# EAGLE design Servo2015_Logic_V1.2 (EAGLE 6.3)

## Sheet 1 of 4: Spannungsversorg
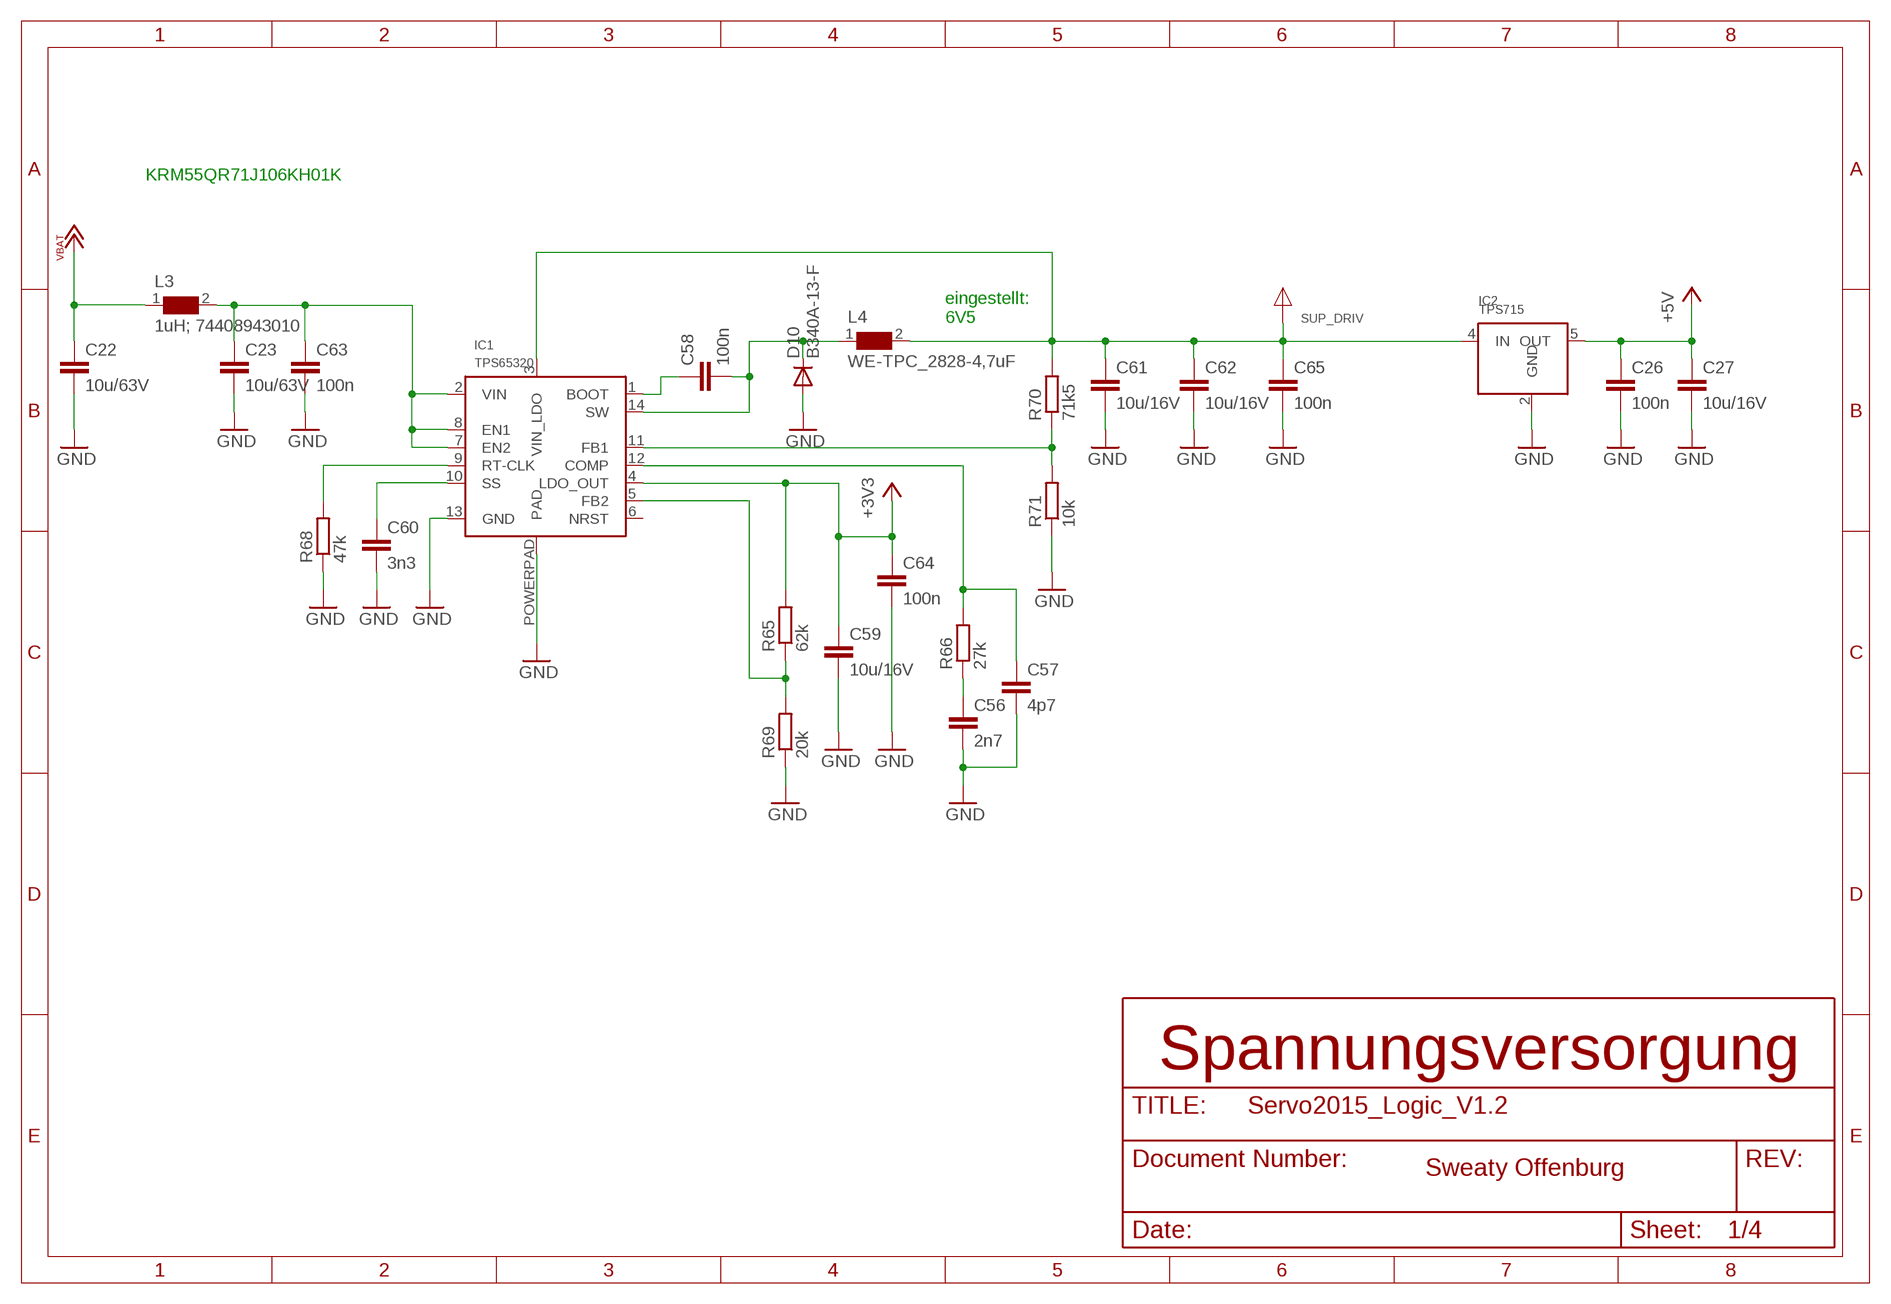
[diagram p0: schematic, sheet 1]

### Parts
C22  10u/63V  C-EUC2220K  [C2220K]
C23  10u/63V  C-EUC2220K  [C2220K]
C26  100n  C-EUC0603  [C0603]
C27  10u/16V  C-EUC0805  [C0805]
C56  2n7  C-EUC0603  [C0603]
C57  4p7  C-EUC0603  [C0603]
C58  100n  C-EUC0603  [C0603]
C59  10u/16V  C-EUC0805  [C0805]
C60  3n3  C-EUC0603  [C0603]
C61  10u/16V  C-EUC0805  [C0805]
C62  10u/16V  C-EUC0805  [C0805]
C63  100n  C-EUC0603  [C0603]
C64  100n  C-EUC0603  [C0603]
C65  100n  C-EUC0603  [C0603]
D10  B340A-13-F  [SMA]
IC1  TPS65320  [R.PDSO.G14_PWP]
IC2  TPS715  [SC-70_DCK_R_PDSO_G5]
L3  1uH; 74408943010  WE-SPC_48XX_4838/4828/4818  [WE-SPC_48XX]
L4  WE-TPC_2828-4,7uF  WE-TPC_2828  [WE-TPC_2828]
R65  62k  R-EU_R0603  [R0603]
R66  27k  R-EU_R0603  [R0603]
R68  47k  R-EU_R0603  [R0603]
R69  20k  R-EU_R0603  [R0603]
R70  71k5  R-EU_R0603  [R0603]
R71  10k  R-EU_R0603  [R0603]

### Nets
+3V3: C59.1 C64.1 IC1.4(LDO_OUT) R65.2 ; also sheet 2,3,4
+5V: C26.1 C27.1 IC2.5(OUT) ; also sheet 2,4
GND: C22.2 C23.2 C26.2 C27.2 C56.2 C57.2 C59.2 C60.2 C61.2 C62.2 C63.2 C64.2 C65.2 D10.A IC1.13(GND) IC1.POWERPAD(PAD) IC2.2(GND) R68.1 R69.1 R71.1 ; also sheet 2,3,4
N$16: C57.1 IC1.12(COMP) R66.2
N$17: C56.1 R66.1
N$18: IC1.5(FB2) R65.1 R69.2
N$23: C58.2 D10.C IC1.14(SW) L4.1
N$25: IC1.11(FB1) R70.1 R71.2
N$26: C60.1 IC1.10(SS)
N$27: IC1.9(RT-CLK) R68.2
N$28: C23.1 C63.1 IC1.2(VIN) IC1.7(EN2) IC1.8(EN1) L3.2
N$30: C58.1 IC1.1(BOOT)
SUP_DRIV: C61.1 C62.1 C65.1 IC1.3(VIN_LDO) IC2.4(IN) L4.2 R70.2 ; also sheet 2
VBAT+: C22.1 L3.1 ; also sheet 2
Unconnected: IC1.6(NRST)

### Notes on the sheet
- KRM55QR71J106KH01K
- eingestellt:
  6V5
- Spannungsversorgung
- Sweaty Offenburg

## Sheet 2 of 4
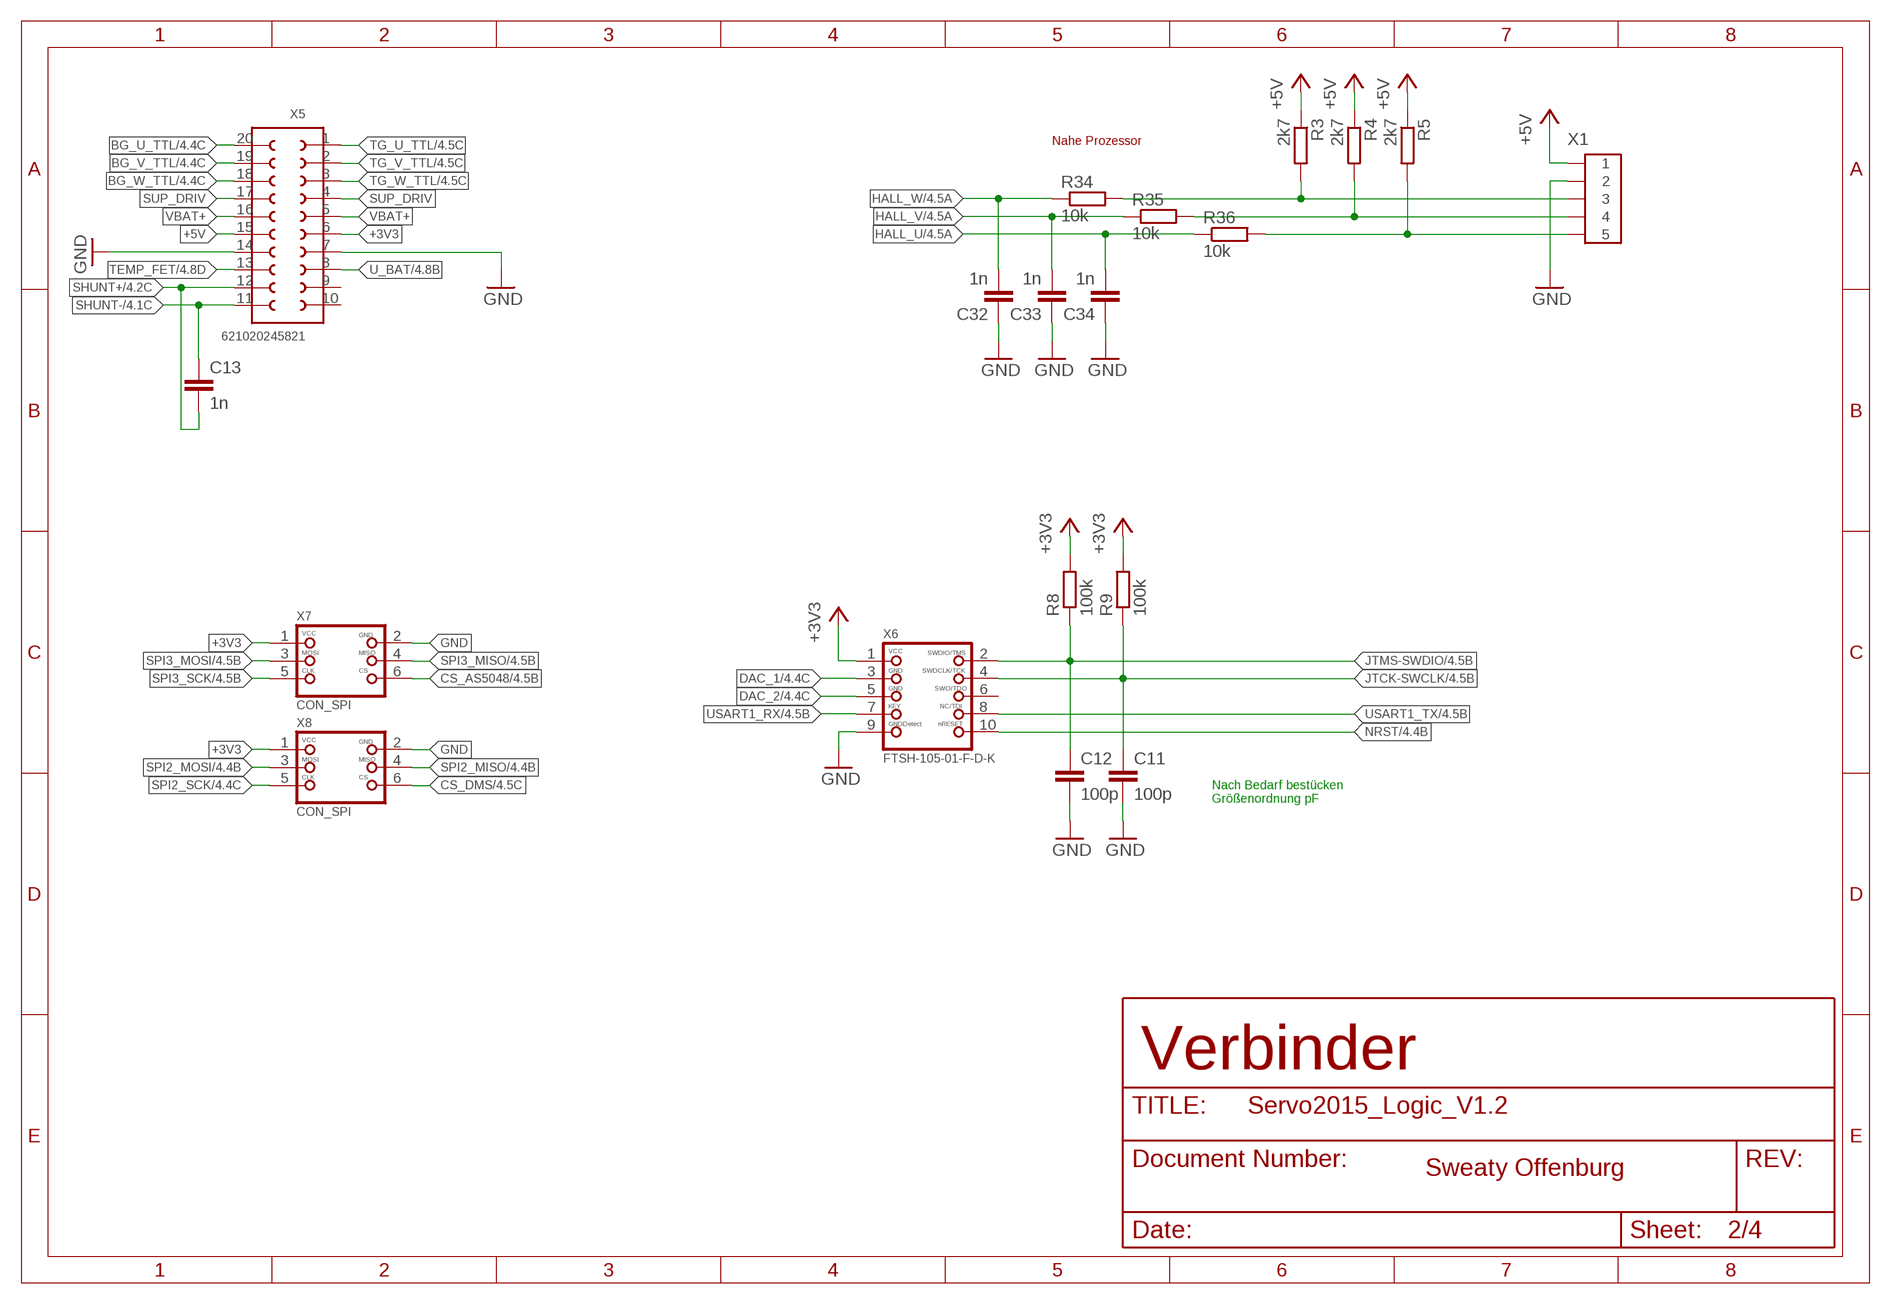
[diagram p1: schematic, sheet 2]

### Parts
C11  100p  C-EUC0603  [C0603]
C12  100p  C-EUC0603  [C0603]
C13  1n  C-EUC0603  [C0603]
C32  1n  C-EUC0603  [C0603]
C33  1n  C-EUC0603  [C0603]
C34  1n  C-EUC0603  [C0603]
R3  2k7  R-EU_R0603  [R0603]
R4  2k7  R-EU_R0603  [R0603]
R5  2k7  R-EU_R0603  [R0603]
R8  100k  R-EU_R0603  [R0603]
R9  100k  R-EU_R0603  [R0603]
R34  10k  R-EU_R0603  [R0603]
R35  10k  R-EU_R0603  [R0603]
R36  10k  R-EU_R0603  [R0603]
X1  HALL-5POL-SERVOBOARD  [MOLEX-SPOX-5POL-VERT]
X5  621020245821  [621020245821]
X6  FTSH-105-01-F-D-K  JTAG-CORTEXM3  [2X05_1.27MM_SMT]
X7  CON_SPI  [2X03_1.27MM_SMT]
X8  CON_SPI  [2X03_1.27MM_SMT]

### Nets
+3V3: R8.2 R9.2 X5.6 X6.1 X7.1 X8.1 ; also sheet 1,3,4
+5V: R3.1 R4.1 R5.1 X1.1 X5.15 ; also sheet 1,4
BG_U_TTL: X5.20 ; also sheet 4
BG_V_TTL: X5.19 ; also sheet 4
BG_W_TTL: X5.18 ; also sheet 4
CS_AS5048: X7.6 ; also sheet 4
CS_DMS: X8.6 ; also sheet 4
DAC_1: X6.3 ; also sheet 4
DAC_2: X6.5 ; also sheet 4
GND: C11.2 C12.2 C32.1 C33.1 C34.1 X1.2 X5.7 X5.14 X6.9 X7.2 X8.2 ; also sheet 1,3,4
HALL_U: C34.2 R36.1 ; also sheet 4
HALL_V: C33.2 R35.1 ; also sheet 4
HALL_W: C32.2 R34.1 ; also sheet 4
JTCK-SWCLK: C11.1 R9.1 X6.4 ; also sheet 4
JTMS-SWDIO: C12.1 R8.1 X6.2 ; also sheet 4
N$4: R3.2 R34.2 X1.3
N$5: R4.2 R35.2 X1.4
N$6: R5.2 R36.2 X1.5
NRST: X6.10 ; also sheet 4
SHUNT+: C13.2 X5.12 ; also sheet 4
SHUNT-: C13.1 X5.11 ; also sheet 4
SPI2_MISO: X8.4 ; also sheet 4
SPI2_MOSI: X8.3 ; also sheet 4
SPI2_SCK: X8.5 ; also sheet 4
SPI3_MISO: X7.4 ; also sheet 4
SPI3_MOSI: X7.3 ; also sheet 4
SPI3_SCK: X7.5 ; also sheet 4
SUP_DRIV: X5.4 X5.17 ; also sheet 1
TEMP_FET: X5.13 ; also sheet 4
TG_U_TTL: X5.1 ; also sheet 4
TG_V_TTL: X5.2 ; also sheet 4
TG_W_TTL: X5.3 ; also sheet 4
U_BAT: X5.8 ; also sheet 4
USART1_RX: X6.7 ; also sheet 4
USART1_TX: X6.8 ; also sheet 4
VBAT+: X5.5 X5.16 ; also sheet 1
Unconnected: X5.9 X5.10 X6.6

### Notes on the sheet
- Nahe Prozessor
- Nach Bedarf bestücken
  Größenordnung pF
- Verbinder
- Sweaty Offenburg

## Sheet 3 of 4: CAN
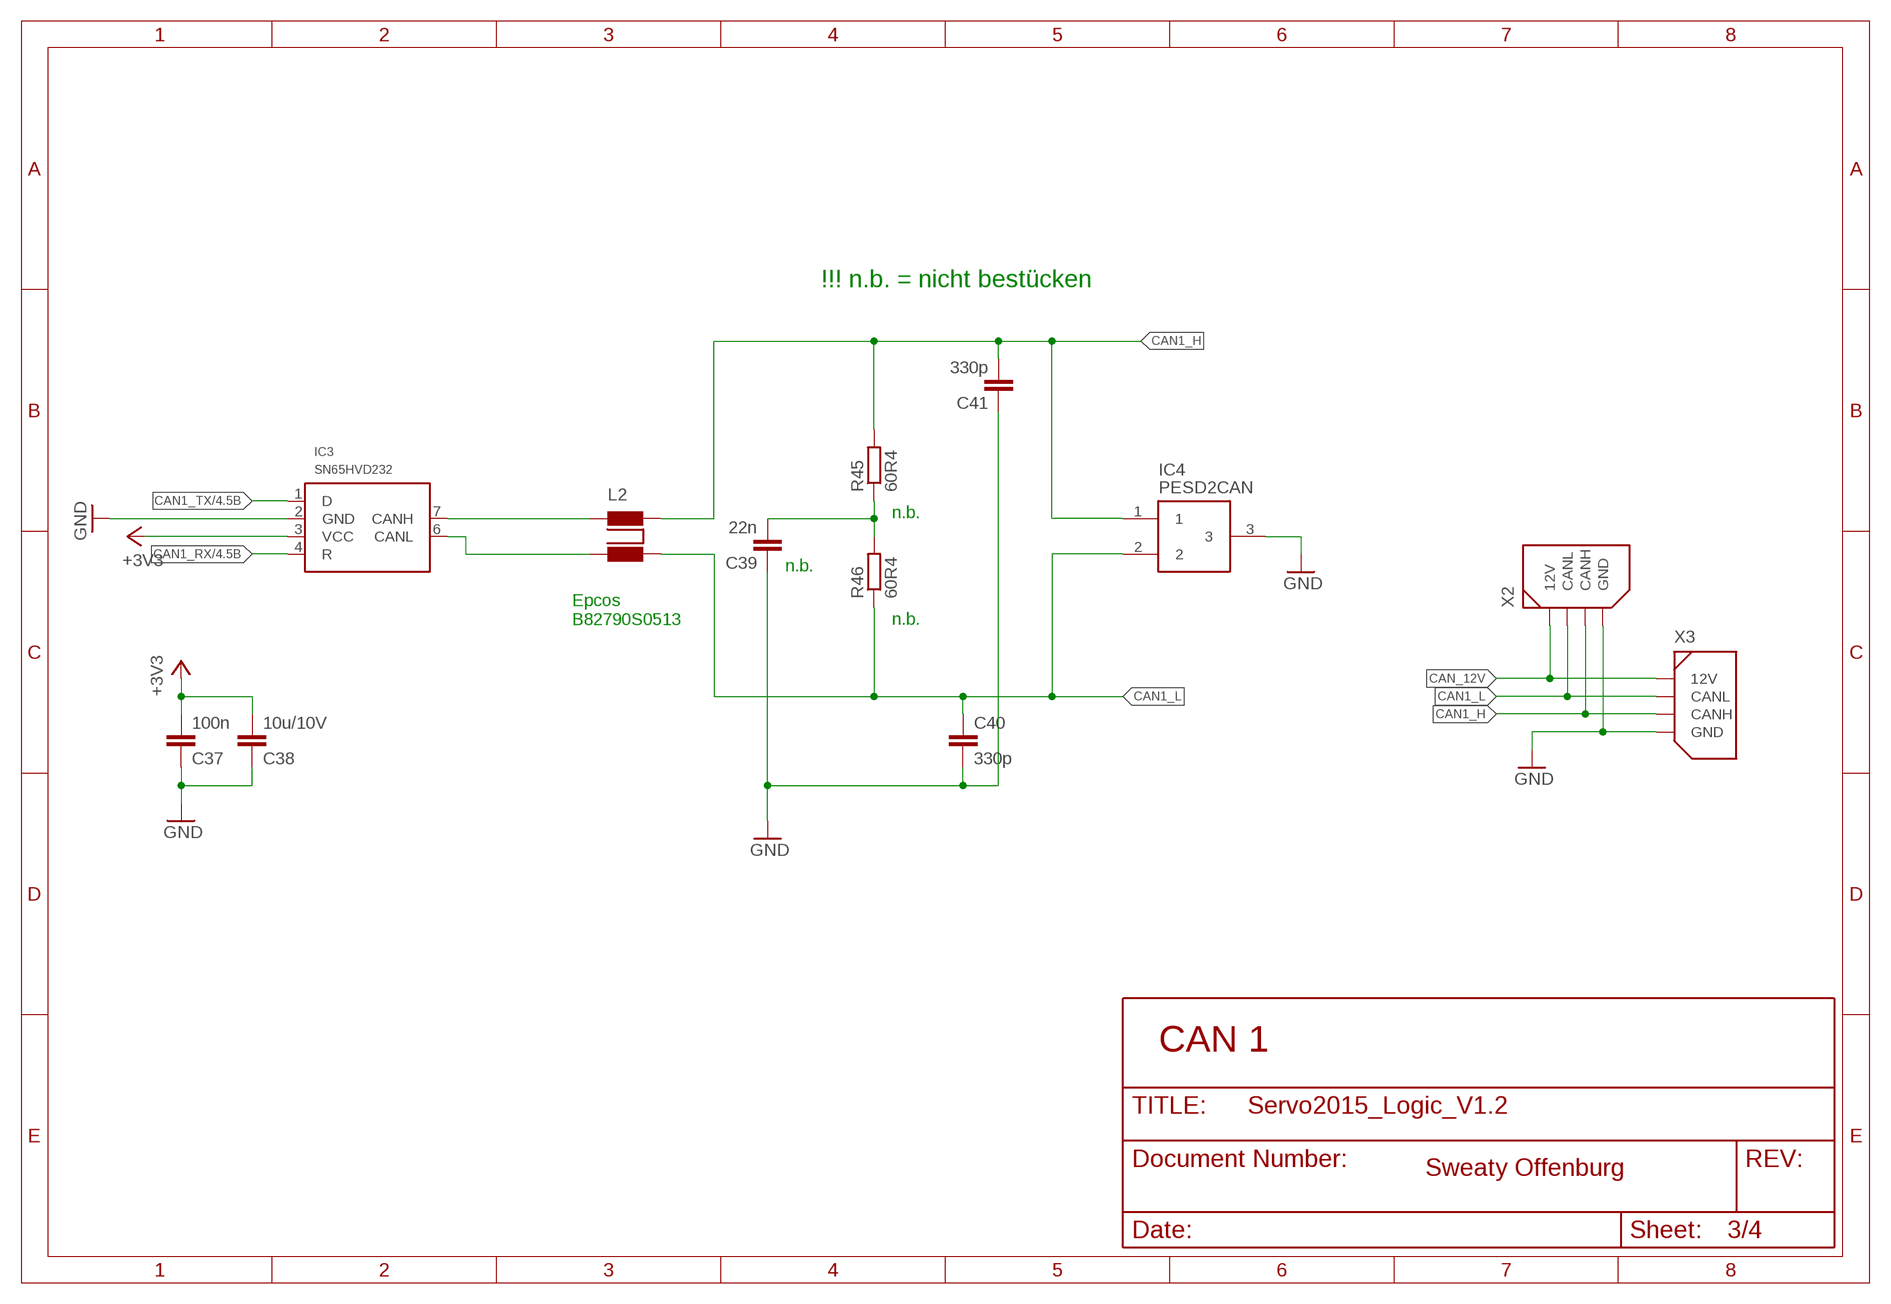
[diagram p2: schematic, sheet 3]

### Parts
C37  100n  C-EUC0603  [C0603]
C38  10u/10V  C-EUC0603  [C0603]
C39  22n  C-EUC0603  [C0603]
C40  330p  C-EUC0603  [C0603]
C41  330p  C-EUC0603  [C0603]
IC3  SN65HVD232  [SO-8]
IC4  PESD2CAN  PESD1CAN  [SOT-23(TO263AB)]
L2  B82790S0513  [B82790C0/S0]
R45  60R4  R-EU_R0805  [R0805]
R46  60R4  R-EU_R0805  [R0805]
X2  CAN-4POL  [MOLEX-SPOX-4PO]
X3  CAN-4POL  [MOLEX-SPOX-4PO]

### Nets
+3V3: C37.2 C38.2 IC3.3(VCC) ; also sheet 1,2,4
CAN1_H: C41.2 IC4.1 L2.2 R45.2 X2.P$3(CANH) X3.P$3(CANH)
CAN1_L: C40.1 IC4.2 L2.3 R46.1 X2.P$2(CANL) X3.P$2(CANL)
CAN1_RX: IC3.4(R) ; also sheet 4
CAN1_TX: IC3.1(D) ; also sheet 4
CAN_12V: X2.P$1(12V) X3.P$1(12V)
GND: C37.1 C38.1 C39.1 C40.2 C41.1 IC3.2(GND) IC4.3 X2.P$4(GND) X3.P$4(GND) ; also sheet 1,2,4
N$38: C39.2 R45.1 R46.2
N$89: IC3.7(CANH) L2.1
N$96: IC3.6(CANL) L2.4

### Notes on the sheet
- !!! n.b. = nicht bestücken
- n.b.
- n.b.
- Epcos 
  B82790S0513
- n.b.
- CAN 1
- Sweaty Offenburg

## Sheet 4 of 4
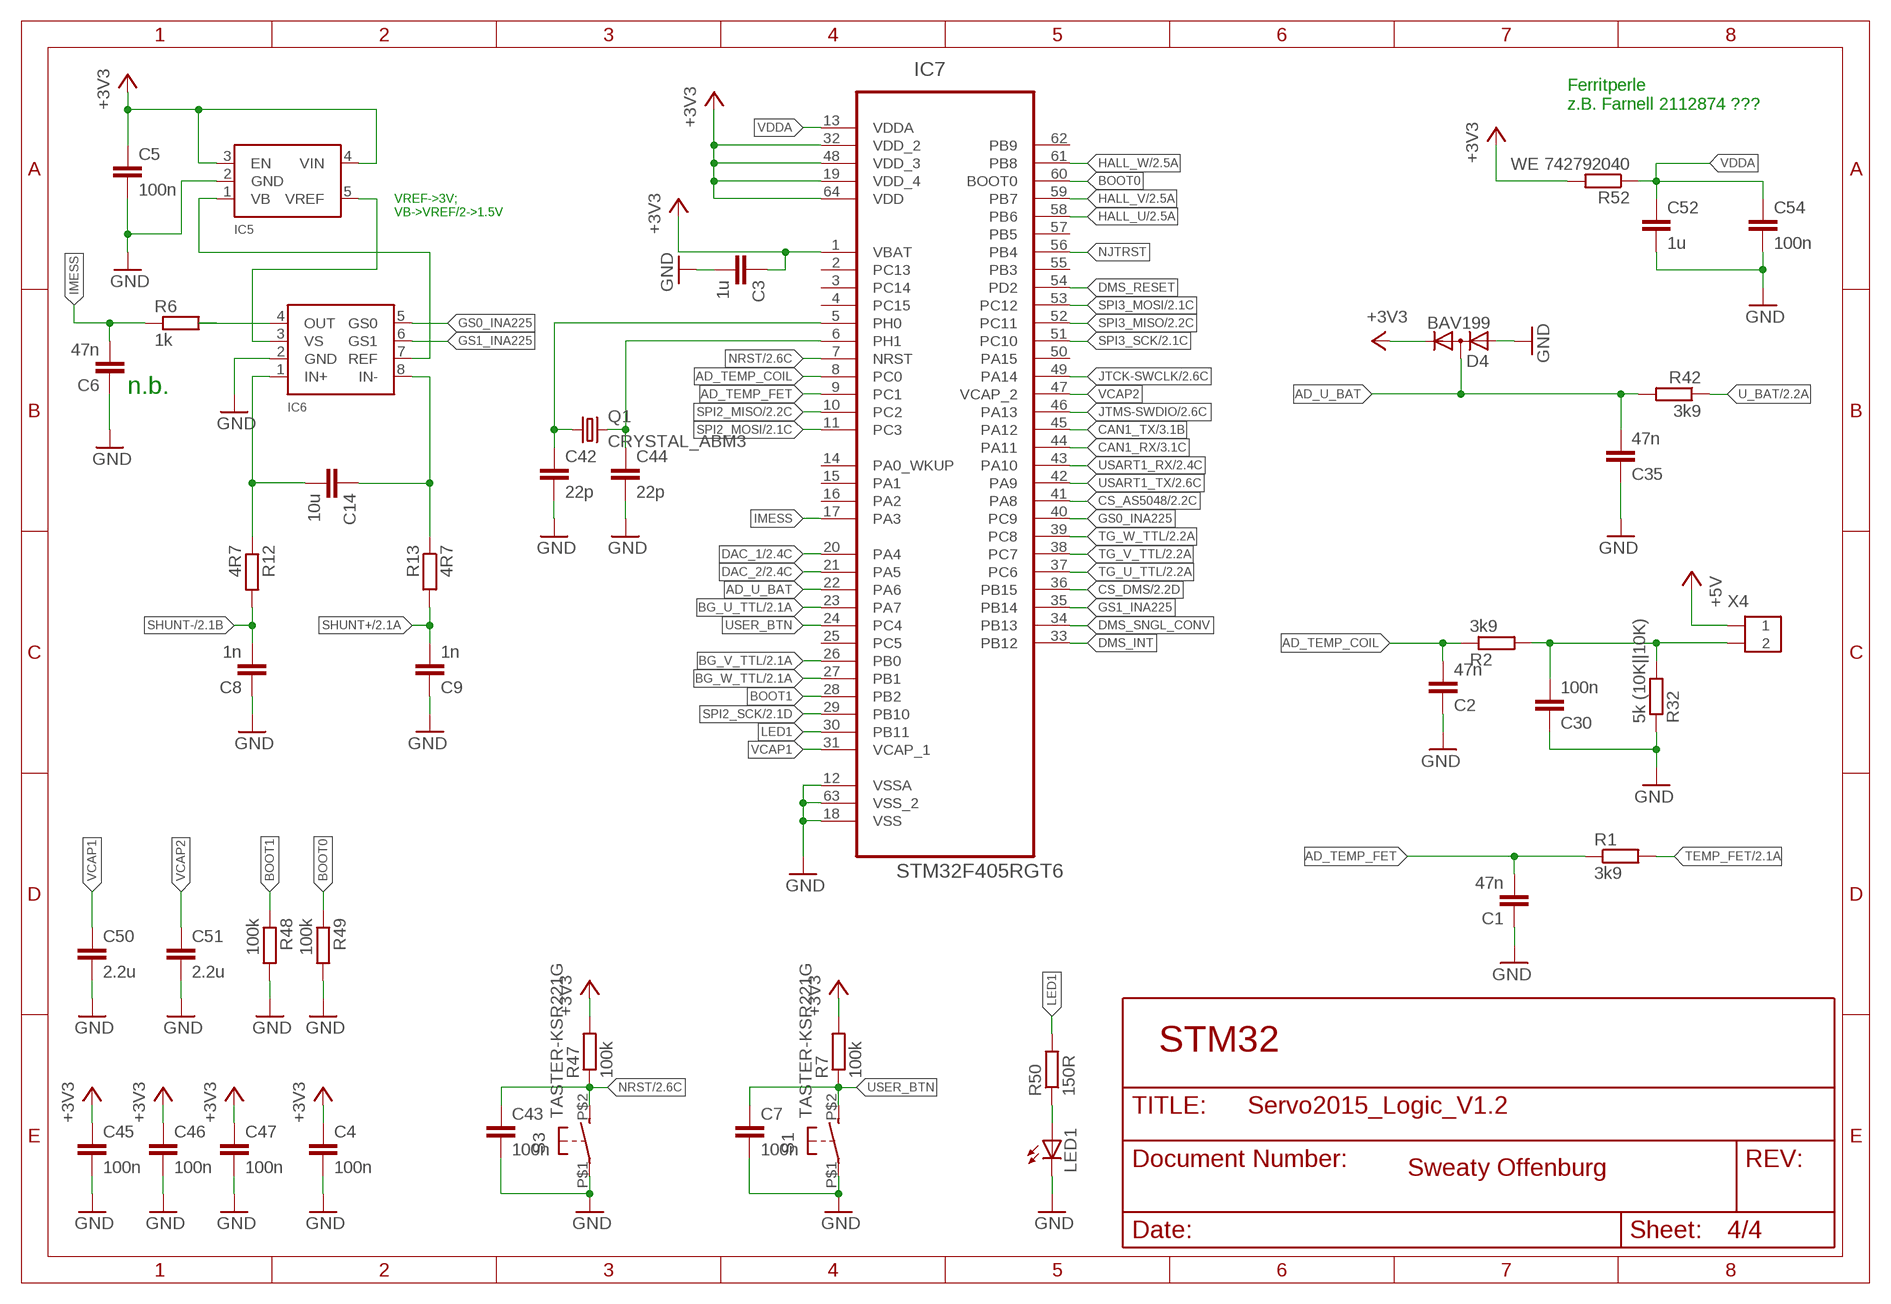
[diagram p3: schematic, sheet 4]

### Parts
C1  47n  C-EUC0603  [C0603]
C2  47n  C-EUC0603  [C0603]
C3  1u  C-EUC0603  [C0603]
C4  100n  C-EUC0603  [C0603]
C5  100n  C-EUC0603  [C0603]
C6  47n  C-EUC0603  [C0603]
C7  100n  C-EUC0603  [C0603]
C8  1n  C-EUC0603  [C0603]
C9  1n  C-EUC0603  [C0603]
C14  10u  C-EUC0603  [C0603]
C30  100n  C-EUC0603  [C0603]
C35  47n  C-EUC0603  [C0603]
C42  22p  C-EUC0603  [C0603]
C43  100n  C-EUC0603  [C0603]
C44  22p  C-EUC0603  [C0603]
C45  100n  C-EUC0603  [C0603]
C46  100n  C-EUC0603  [C0603]
C47  100n  C-EUC0603  [C0603]
C50  2.2u  C-EUC0603  [C0603]
C51  2.2u  C-EUC0603  [C0603]
C52  1u  C-EUC0603  [C0603]
C54  100n  C-EUC0603  [C0603]
D4  BAV199  [SOT23]
IC5  REF2030  [R-PDSO-G5]
IC6  INA225  [S-PDSO-G8]
IC7  STM32F405RGT6  [QFP50P1200X1200X160-64N]
LED1  LEDCHIPLED_0805  [CHIPLED_0805]
Q1  CRYSTAL_ABM3  [CRYSTAL-5X3.2]
R1  3k9  R-EU_R0603  [R0603]
R2  3k9  R-EU_R0603  [R0603]
R6  1k  R-EU_R0603  [R0603]
R7  100k  R-EU_R0603  [R0603]
R12  4R7  R-EU_R0603  [R0603]
R13  4R7  R-EU_R0603  [R0603]
R32  5k (10K||10K)  R-EU_R0603  [R0603]
R42  3k9  R-EU_R0603  [R0603]
R47  100k  R-EU_R0603  [R0603]
R48  100k  R-EU_R0603  [R0603]
R49  100k  R-EU_R0603  [R0603]
R50  150R  R-EU_R0603  [R0603]
R52  WE 742792040  R-EU_R0805  [R0805]
S1  TASTER-KSR221G  [KSR-TASTER]
S3  TASTER-KSR221G  [KSR-TASTER]
X4  KRAFTSENSOR-2POL  [MOLEX-SPOX-2POL]

### Nets
+3V3: C3.1 C4.1 C5.1 C45.1 C46.1 C47.1 D4.2(C) IC5.3(EN) IC5.4(VIN) IC7.1(VBAT) IC7.19(VDD_4) IC7.32(VDD_2) IC7.48(VDD_3) IC7.64(VDD) R7.2 R47.2 R52.2 ; also sheet 1,2,3
+5V: X4.P$1 ; also sheet 1,2
AD_TEMP_COIL: C2.2 IC7.8(PC0) R2.1
AD_TEMP_FET: C1.2 IC7.9(PC1) R1.1
AD_U_BAT: C35.2 D4.3(AC) IC7.22(PA6) R42.2
BG_U_TTL: IC7.23(PA7) ; also sheet 2
BG_V_TTL: IC7.26(PB0) ; also sheet 2
BG_W_TTL: IC7.27(PB1) ; also sheet 2
BOOT0: IC7.60(BOOT0) R49.1
BOOT1: IC7.28(PB2) R48.1
CAN1_RX: IC7.44(PA11) ; also sheet 3
CAN1_TX: IC7.45(PA12) ; also sheet 3
CS_AS5048: IC7.41(PA8) ; also sheet 2
CS_DMS: IC7.36(PB15) ; also sheet 2
DAC_1: IC7.20(PA4) ; also sheet 2
DAC_2: IC7.21(PA5) ; also sheet 2
DMS_INT: IC7.33(PB12)
DMS_RESET: IC7.54(PD2)
DMS_SNGL_CONV: IC7.34(PB13)
GND: C1.1 C2.1 C3.2 C4.2 C5.2 C6.1 C7.2 C8.1 C9.1 C30.1 C35.1 C42.2 C43.2 C44.2 C45.2 C46.2 C47.2 C50.2 C51.2 C52.2 C54.2 D4.1(A) IC5.2(GND) IC6.2(GND) IC7.12(VSSA) IC7.18(VSS) IC7.63(VSS_2) LED1.C R32.1 R48.2 R49.2 S1.P$1(P) S3.P$1(P) ; also sheet 1,2,3
GS0_INA225: IC6.5(GS0) IC7.40(PC9)
GS1_INA225: IC6.6(GS1) IC7.35(PB14)
HALL_U: IC7.58(PB6) ; also sheet 2
HALL_V: IC7.59(PB7) ; also sheet 2
HALL_W: IC7.61(PB8) ; also sheet 2
IC6: C14.2 IC6.1(IN+) R12.1
IMESS: C6.2 IC7.17(PA3) R6.1
JTCK-SWCLK: IC7.49(PA14) ; also sheet 2
JTMS-SWDIO: IC7.46(PA13) ; also sheet 2
LED1: IC7.30(PB11) R50.2
N$1: C14.1 IC6.8(IN-) R13.1
N$3: LED1.A R50.1
N$7: IC6.4(OUT) R6.2
N$8: IC5.5(VREF) IC6.3(VS)
N$10: IC5.1(VB) IC6.7(REF)
N$70: C44.1 IC7.6(PH1) Q1.P$2
N$85: C42.1 IC7.5(PH0) Q1.P$1
NJTRST: IC7.56(PB4)
NRST: C43.1 IC7.7(NRST) R47.1 S3.P$2(S) ; also sheet 2
SHUNT+: C9.2 R13.2 ; also sheet 2
SHUNT-: C8.2 R12.2 ; also sheet 2
SPI2_MISO: IC7.10(PC2) ; also sheet 2
SPI2_MOSI: IC7.11(PC3) ; also sheet 2
SPI2_SCK: IC7.29(PB10) ; also sheet 2
SPI3_MISO: IC7.52(PC11) ; also sheet 2
SPI3_MOSI: IC7.53(PC12) ; also sheet 2
SPI3_SCK: IC7.51(PC10) ; also sheet 2
TEMP_COIL: C30.2 R2.2 R32.2 X4.P$2
TEMP_FET: R1.2 ; also sheet 2
TG_U_TTL: IC7.37(PC6) ; also sheet 2
TG_V_TTL: IC7.38(PC7) ; also sheet 2
TG_W_TTL: IC7.39(PC8) ; also sheet 2
U_BAT: R42.1 ; also sheet 2
USART1_RX: IC7.43(PA10) ; also sheet 2
USART1_TX: IC7.42(PA9) ; also sheet 2
USER_BTN: C7.1 IC7.24(PC4) R7.1 S1.P$2(S)
VCAP1: C50.1 IC7.31(VCAP_1)
VCAP2: C51.1 IC7.47(VCAP_2)
VDDA: C52.1 C54.1 IC7.13(VDDA) R52.1
Unconnected: IC7.2(PC13) IC7.3(PC14) IC7.4(PC15) IC7.14(PA0_WKUP) IC7.15(PA1) IC7.16(PA2) IC7.25(PC5) IC7.50(PA15) IC7.55(PB3) IC7.57(PB5) IC7.62(PB9)

### Notes on the sheet
- Ferritperle
  z.B. Farnell 2112874 ???
- VREF->3V;
  VB->VREF/2->1.5V
- n.b.
- STM32
- Sweaty Offenburg

## Library data of the parts
C1-C9 C11-C14 C22 C23 C26 C27 C30 C32-C35 C37-C47 C50-C52 C54 C56-C65 = rcl:C-EU: CAPACITOR, European symbol
D4 = diode:BAV199: DIODE low-leakage double diode
D10 = B340A-13-F:B340A-13-F
IC1 = TPS65320:TPS65320
IC2 = TPS71x:TPS715
IC3 = SN65HVD23x:SN65HVD232
IC4 = PESD1CAN:PESD1CAN
IC5 = REF2030:REF2030
IC6 = INA225:INA225
IC7 = STM32F405-Farnell:STM32F405RGT6: IC, MCU, 32BIT, 1MB FLASH, 64LQFP; MPN: STM32F405RGT6; OC_FARNELL: 2064363; OC_NEWARK: 73T2329; PACKAGE: 64LQFP; SUPPLIER: STMicroelectronics
L2 = Common Chocke:B82790S0513
L3 = EagleLibrary_Wuerth_Elektronik_eiSos_V6_20140807:WE-SPC_48XX: SMD-Shielded Power Inductor WE-SPC <http://katalog.we-online.de/media/images/eisos/IndSPC_pf2.jpg> Details see: http://katalog.we-online.de/en/pbs/WE-SPC? Updated by Dan Xu 2014-07-11 2014 (C) Würth Elektronik
L4 = EagleLibrary_Wuerth_Elektronik_eiSos_V6_20140807:WE-TPC: Shielded Tiny Power Inductor WE-TPC - Extremely flat power inductor - High current capability - High reliability and perfect soldering characteristics because of integrated soldering pad - magnetically shielded -- Portable power like PDA, digital camera, PCMICA-cards and displays -- DC/DC-converter -- Recommended for switching regulator IC's from Linear Technology, National Semiconductor, Texas Instruments and Fairchild Semiconductor <http://katalog.we-online.de/media/images/eisos/IndTPC_pf2.jpg> Details see: http://katalog.we-online.de/en/pbs/WE-TPC? Updated by Dan Xu 2014-07-11 2014 (C) Würth Elektronik
LED1 = led:LED: LED OSRAM: - CHIPLED LG R971, LG N971, LY N971, LG Q971, LY Q971, LO R971, LY R971 LH N974, LH R974 LS Q976, LO Q976, LY Q976 LO Q996 - Hyper CHIPLED LW Q18S LB Q993, LB Q99A, LB R99A - SideLED LS A670, LO A670, LY A670, LG A670, LP A670 LB A673, LV A673, LT A673, LW A673 LH A674 LY A675 LS A676, LA A676, LO A676, LY A676, LW A676 LS A679, LY A679, LG A679 - Hyper Micro SIDELED® LS Y876, LA Y876, LO Y876, LY Y876 LT Y87S - SmartLED LW L88C, LW L88S LB L89C, LB L89S, LG L890 LS L89K, LO L89K, LY L89K LS L896, LA L896, LO L896, LY L896 - TOPLED LS T670, LO T670, LY T670, LG T670, LP T670 LSG T670, LSP T670, LSY T670, LOP T670, LYG T670 LG T671, LOG T671, LSG T671 LB T673, LV T673, LT T673, LW T673 LH T674 LS T676, LA T676, LO T676, LY T676, LB T676, LH T676, LSB T676, LW T676 LB T67C, LV T67C, LT T67C, LS T67K, LO T67K, LY T67K, LW E67C LS E67B, LA E67B, LO E67B, LY E67B, LB E67C, LV E67C, LT E67C LW T67C LS T679, LY T679, LG T679 LS T770, LO T770, LY T770, LG T770, LP T770 LB T773, LV T773, LT T773, LW T773 LH T774 LS E675, LA E675, LY E675, LS T675 LS T776, LA T776, LO T776, LY T776, LB T776 LHGB T686 LT T68C, LB T68C - Hyper Mini TOPLED® LB M676 - Mini TOPLED Santana® LG M470 LS M47K, LO M47K, LY M47K Source: http://www.osram.convergy.de LUXEON: - LUMILED® LXK2-PW12-R00, LXK2-PW12-S00, LXK2-PW14-U00, LXK2-PW14-V00 LXK2-PM12-R00, LXK2-PM12-S00, LXK2-PM14-U00 LXK2-PE12-Q00, LXK2-PE12-R00, LXK2-PE12-S00, LXK2-PE14-T00, LXK2-PE14-U00 LXK2-PB12-K00, LXK2-PB12-L00, LXK2-PB12-M00, LXK2-PB14-N00, LXK2-PB14-P00, LXK2-PB14-Q00 LXK2-PR12-L00, LXK2-PR12-M00, LXK2-PR14-Q00, LXK2-PR14-R00 LXK2-PD12-Q00, LXK2-PD12-R00, LXK2-PD12-S00 LXK2-PH12-R00, LXK2-PH12-S00 LXK2-PL12-P00, LXK2-PL12-Q00, LXK2-PL12-R00 Source: www.luxeon.com KINGBRIGHT: KA-3528ASYC Source: www.kingbright.com
Q1 = Crytal_ABM3:CRYSTAL_ABM3
R1-R9 R12 R13 R32 R34-R36 R42 R45-R50 R52 R65 R66 R68-R71 = rcl:R-EU_: RESISTOR, European symbol
S1 S3 = Taster-KSR221G:TASTER-KSR221G: KSR221G LFS
X1 = Sweaty-Verbinder:HALL-5POL-SERVOBOARD
X2 X3 = Sweaty-Verbinder:CAN-4POL
X4 = Sweaty-Verbinder:KRAFTSENSOR-2POL
X5 = Wurth_Elektronik_Electromechanic_Board_to_Board_Connectors_rev15b:621020245821: WR-PHD 2.00mm Dual SMT Pin Header SMT, 20 Pins=>Code :WR-PHD_SMD_Low-Profile_621020245821 <http://katalog.we-online.de/media/images/eican/WR-PHD_SMD_Low-Profile_621010245821.jpg> Details see: http://katalog.we-online.de/en/em/621_0xx_245_821 Created 2014-06-03, Karrer Zheng 2014 (C) Würth Elektronik
X6 = microbuilder:JTAG-CORTEXM3: Serial Wire (SW-DP) Connector This standard 0.05" 10-pin connector is for use with the Cortex M0/M3's native SWD (serial wire debugger) interface (SW-DP). Some boards support a 20-pin combined JTAG+SWD connector (SWJ-DP), such as the LPC1700 family, but many smaller devices only work with SWD which typically use the smaller 10-pin SW-DP connecter (the LPC1300 family, for example, only supports SWD). 2x05 1.27mm/0.05" Connector: This is the standard SMT connector defined by ARM for all Cortex devices, and should be used in most situations and for forward-compatibility since any new devices coming to market will likely use this connector. MOLEX 10 Pin 0.1" Connector: This 0.1" 10 pin connector has the same pin layout as the standard 0.05" connector, but is easier to work with if you are using standard jumper wires or custom cables to connect your SWD hardware. MOLEX 20 Pin 0.1" Connector: This 0.1" 20 pin connector is the same model used for ARM7/ARM9 JTAG debuggers, but is connected to match the pins on the Segger J-Link for ARM (which supports both JTAG and SWD debugging). See the following document from ARM for more information on Cortex M3 Debug Connectors: http://infocenter.arm.com/help/topic/com.arm.doc.faqs/attached/13634/cortex_debug_connectors.pdf And the following page for an overview with images of the different connector types: http://www.keil.com/peripherals/coresight/connectors.asp
X7 X8 = microbuilder:CON_SPI: 2x03 1.27mm/0.05" Connecto:

## Board
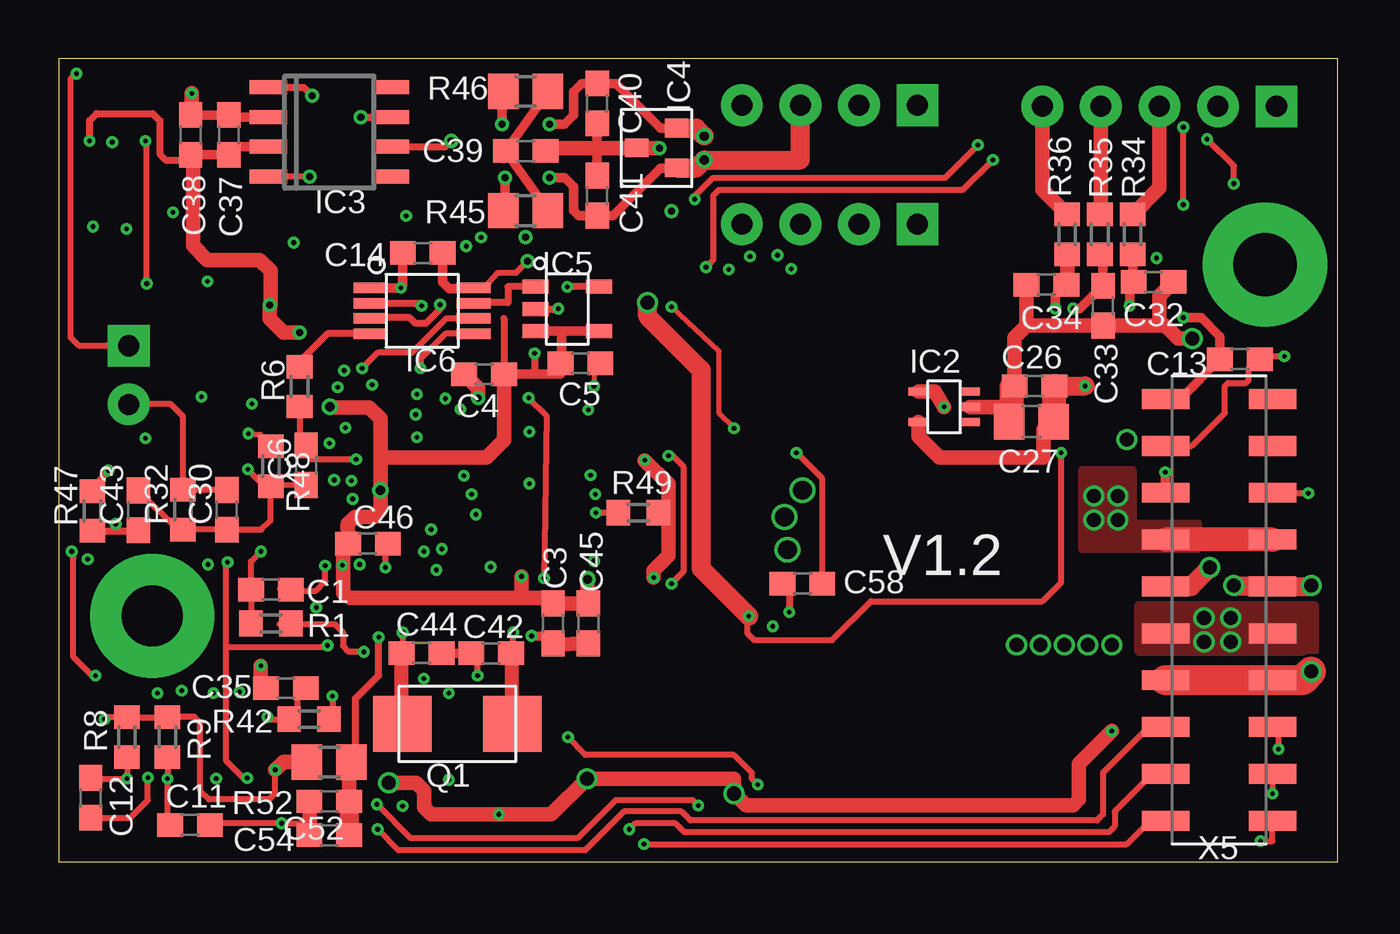
[diagram p4: board, top side]
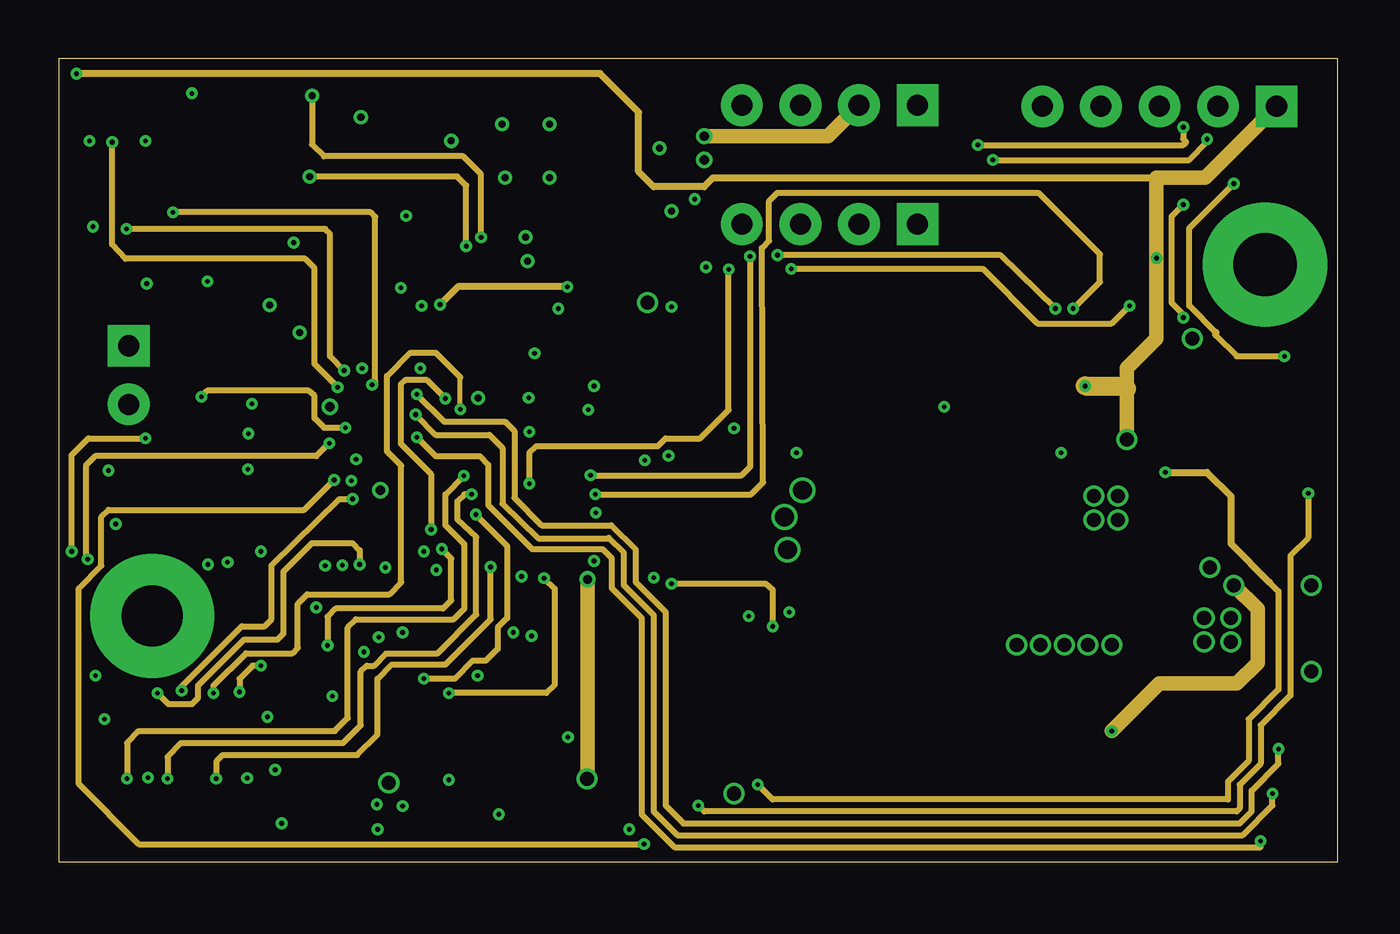
[diagram p5: board, inner layer Route2]
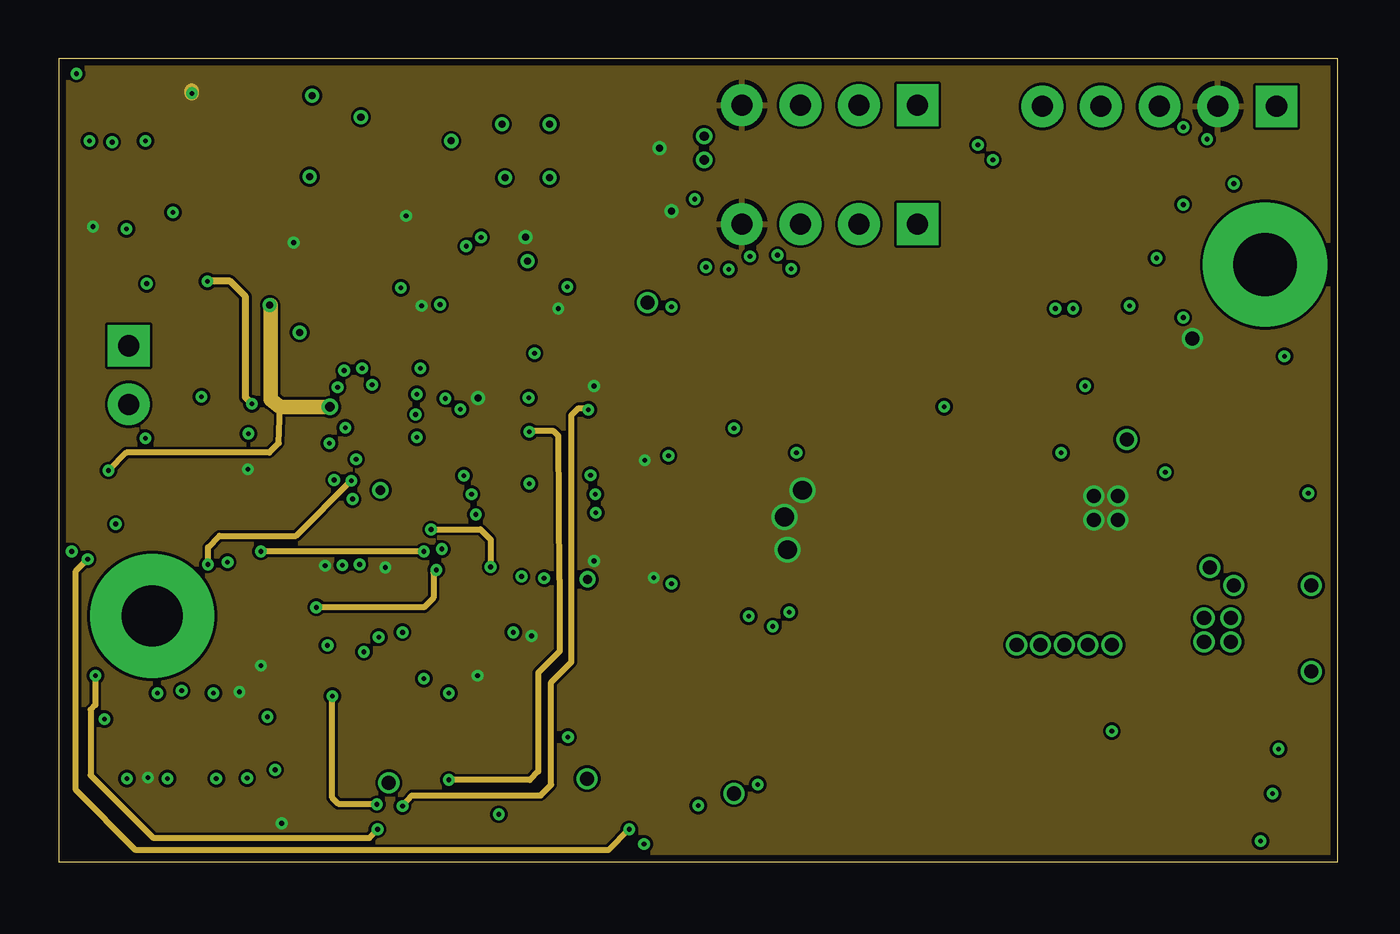
[diagram p6: board, inner layer GND]
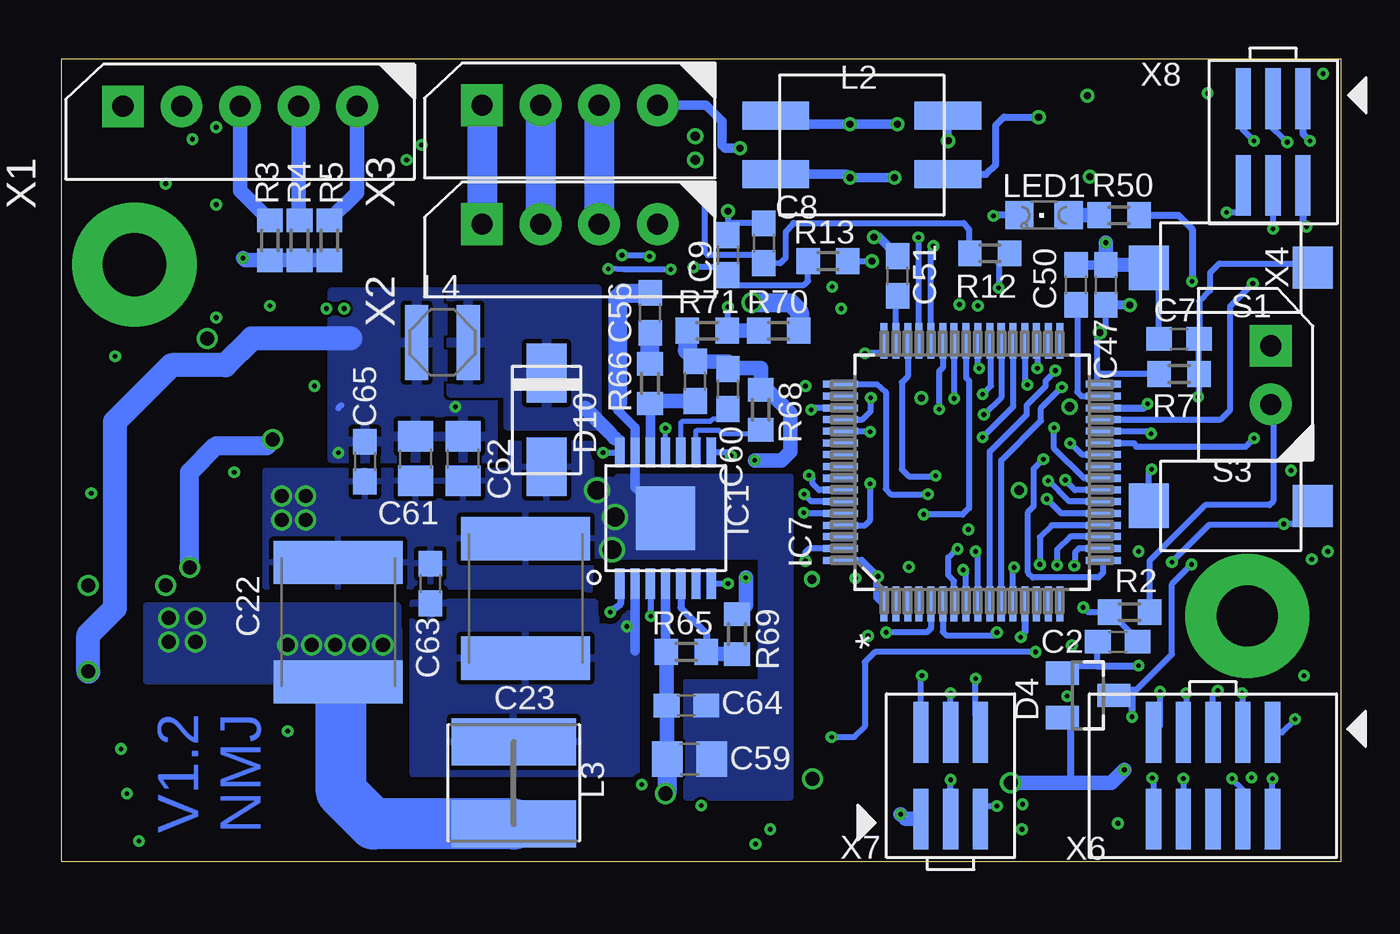
[diagram p7: board, bottom side, seen from below]

Size 54.6 x 34.3 mm. Coordinates in mm from the lower left corner, seen from the top.
Outline: 0,0 54.6,0 54.6,34.3 0,34.3 0,0
Copper layers (1+2*15+16): Top 0.035mm / dielectric 0.36mm / Route2 0.035mm / dielectric 0.71mm / GND 0.035mm / dielectric 0.36mm / Bottom 0.035mm
Design rules "Becker_Müller_4Lagen_Fine": minimum track width 0.12mm, minimum drill 0.15mm, track to track 0.12mm, track to pad 0.12mm, pad to pad 0.12mm, via to via 0.12mm, smd to smd 0.12mm, copper to edge 0.3mm, drill to drill 10mil, minimum pad ring 0.15mm, minimum via ring 0.15mm, stop-mask expansion 0.05mm, vias tented up to drill 0mil, thermal gap 8mil

### Footprints (pad centres in the part's own frame; a part is rotated, then mirrored left to right if it is on the bottom)
C0603 = smd 1.1 x 1: 1 -0.85,0; 2 0.85,0
C2220K = smd 1.85 x 5.5: 1 -2.55,0; 2 2.55,0
C0805 = smd 1.3 x 1.5: 1 -0.95,0; 2 0.95,0
SOT23 = smd 1 x 1.4: 1 -0.95,-1.1; 2 0.95,-1.1; 3 0,1.1
SMA = smd 2.5 x 1.7: A 2,0; C -2,0
R.PDSO.G14_PWP = smd 0.4 x 1.3: 1 -1.95,-2.8; 2 -1.3,-2.8; 3 -0.65,-2.8; 4 0,-2.8; 5 0.65,-2.8; 6 1.3,-2.8; 7 1.95,-2.8; 8 1.95,2.8; 9 1.3,2.8; 10 0.65,2.8; 11 0,2.8; 12 -0.65,2.8; 13 -1.3,2.8; 14 -1.95,2.8 | smd 2.5 x 2.7: POWERPAD 0,0
SC-70_DCK_R_PDSO_G5 = smd 0.35 x 0.85: 1 -0.65,-1.1; 2 0,-1.1; 3 0.65,-1.1; 4 0.65,1.1; 5 -0.65,1.1
SO-8 = smd 0.6 x 1.6: 1 -1.905,-2.6; 2 -0.635,-2.6; 3 0.635,-2.6; 4 1.905,-2.6; 5 1.905,2.6; 6 0.635,2.6; 7 -0.635,2.6; 8 -1.905,2.6
SOT-23(TO263AB) = smd 0.8 x 1: 1 0.85,0.85; 2 -0.85,0.85; 3 0,-0.85
R-PDSO-G5 = smd 0.6 x 1.1: 1 -0.95,-1.35; 2 0,-1.35; 3 0.95,-1.35; 4 0.95,1.35; 5 -0.95,1.35
S-PDSO-G8 = smd 0.45 x 1.45: 1 -0.975,-2.2; 2 -0.325,-2.2; 3 0.325,-2.2; 4 0.975,-2.2; 5 0.975,2.2; 6 0.325,2.2; 7 -0.325,2.2; 8 -0.975,2.2
QFP50P1200X1200X160-64N = smd 1.5 x 0.3: 1 -5.613,3.759; 2 -5.613,3.251; 3 -5.613,2.743; 4 -5.613,2.261; 5 -5.613,1.753; 6 -5.613,1.245; 7 -5.613,0.762; 8 -5.613,0.254; 9 -5.613,-0.254; 10 -5.613,-0.762; 11 -5.613,-1.245; 12 -5.613,-1.753; 13 -5.613,-2.261; 14 -5.613,-2.743; 15 -5.613,-3.251; 16 -5.613,-3.759; 33 5.613,-3.759; 34 5.613,-3.251; 35 5.613,-2.743; 36 5.613,-2.261; 37 5.613,-1.753; 38 5.613,-1.245; 39 5.613,-0.762; 40 5.613,-0.254; 41 5.613,0.254; 42 5.613,0.762; 43 5.613,1.245; 44 5.613,1.753; 45 5.613,2.261; 46 5.613,2.743; 47 5.613,3.251; 48 5.613,3.759 | smd 0.3 x 1.5: 17 -3.759,-5.613; 18 -3.251,-5.613; 19 -2.743,-5.613; 20 -2.261,-5.613; 21 -1.753,-5.613; 22 -1.245,-5.613; 23 -0.762,-5.613; 24 -0.254,-5.613; 25 0.254,-5.613; 26 0.762,-5.613; 27 1.245,-5.613; 28 1.753,-5.613; 29 2.261,-5.613; 30 2.743,-5.613; 31 3.251,-5.613; 32 3.759,-5.613; 49 3.759,5.613; 50 3.251,5.613; 51 2.743,5.613; 52 2.261,5.613; 53 1.753,5.613; 54 1.245,5.613; 55 0.762,5.613; 56 0.254,5.613; 57 -0.254,5.613; 58 -0.762,5.613; 59 -1.245,5.613; 60 -1.753,5.613; 61 -2.261,5.613; 62 -2.743,5.613; 63 -3.251,5.613; 64 -3.759,5.613
B82790C0/S0 = smd 2.85 x 1.2: 1 -3.675,1.25; 2 3.675,1.25; 3 3.675,-1.25; 4 -3.675,-1.25
WE-SPC_48XX = smd 2 x 5.3: 1 -1.75,0; 2 1.75,0
WE-TPC_2828 = smd 3.2 x 1: 1 0,1.1; 2 0,-1.1
CHIPLED_0805 = smd 1.2 x 1.2: A 0,-1.05; C 0,1.05
CRYSTAL-5X3.2 = smd 2.5 x 2.4: P$1 -2.35,0; P$2 2.35,0
R0603 = smd 1 x 1.1: 1 -0.85,0; 2 0.85,0
R0805 = smd 1.3 x 1.5: 1 -0.95,0; 2 0.95,0
KSR-TASTER = smd 1.7 x 1.9: P$1 -3.5,0 | smd 1.7 x 1.8: P$2 3.5,0
MOLEX-SPOX-5POL-VERT = drill 0.9 pad 1.778 square: 1 -5,0 | drill 0.9 pad 1.778: 2 -2.5,0; 3 0,0; 4 2.5,0; 5 5,0
MOLEX-SPOX-4PO = drill 0.9 pad 1.778 square: P$1 -2.63,0.56 | drill 0.9 pad 1.778: P$2 -0.13,0.56; P$3 2.37,0.56; P$4 4.87,0.56
MOLEX-SPOX-2POL = drill 0.9 pad 1.778 square: P$1 -1.36,0.56 | drill 0.9 pad 1.778: P$2 1.14,0.56
621020245821 = smd 0.85 x 2.03: 1 -9,-2.285; 2 -7,-2.285; 3 -5,-2.285; 4 -3,-2.285; 5 -1,-2.285; 6 1,-2.285; 7 3,-2.285; 8 5,-2.285; 9 7,-2.285; 10 9,-2.285; 11 9,2.285; 12 7,2.285; 13 5,2.285; 14 3,2.285; 15 1,2.285; 16 -1,2.285; 17 -3,2.285; 18 -5,2.285; 19 -7,2.285; 20 -9,2.285
2X05_1.27MM_SMT = smd 0.65 x 2.6: 1 -2.54,-1.85; 2 -2.54,1.85; 3 -1.27,-1.85; 4 -1.27,1.85; 5 0,-1.85; 6 0,1.85; 7 1.27,-1.85; 8 1.27,1.85; 9 2.54,-1.85; 10 2.54,1.85
2X03_1.27MM_SMT = smd 0.65 x 2.6: 1 -1.27,-1.85; 2 -1.27,1.85; 3 0,-1.85; 4 0,1.85; 5 1.27,-1.85; 6 1.27,1.85

### Placement (x,y rotation side)
C1  9.07,11.63 180 top
C2  9.53,9.4 0 bottom
C3  21.11,10.19 270 top
C4  18.16,20.83 180 top
C5  22.27,21.28 0 top
C6  10.57,16.94 90 top
C7  6.91,22.33 180 bottom
C8  24.64,26.42 270 bottom
C9  26.16,25.91 270 bottom
C11  5.61,1.57 0 top
C12  1.37,2.74 270 top
C13  50.42,21.46 0 top
C14  15.54,26.01 180 top
C22  42.8,10.24 90 bottom
C23  34.8,11.25 90 bottom
C26  41.66,20.32 180 top
C27  41.53,18.8 180 top
C30  7.19,15.04 90 top
C32  46.74,24.77 180 top
C33  44.58,23.75 90 top
C34  42.16,24.64 0 top
C35  9.7,7.42 0 top
C37  7.26,31.04 270 top
C38  5.64,31.04 270 top
C39  19.94,30.35 180 top
C40  22.99,32.38 270 top
C41  22.99,28.45 270 top
C42  18.47,8.92 180 top
C43  3.4,15.01 90 top
C44  15.49,8.92 0 top
C45  22.61,10.19 270 top
C46  13.21,13.59 0 top
C47  10.03,24.64 90 bottom
C50  11.3,24.64 90 bottom
C51  18.92,25.02 90 bottom
C52  11.56,2.59 180 top
C54  11.56,1.14 180 top
C56  29.49,23.44 90 bottom
C57  27.56,20.52 90 bottom
C58  31.75,11.89 0 top
C59  27.81,4.39 0 bottom
C60  26.16,20.19 90 bottom
C61  39.5,17.22 270 bottom
C62  37.47,17.22 270 bottom
C63  38.86,11.89 90 bottom
C64  27.94,6.68 0 bottom
C65  41.66,17.09 270 bottom
D4  10.79,7.11 270 bottom
D10  33.91,18.87 270 bottom
IC1  28.83,14.68 0 bottom
IC2  37.8,19.43 90 top
IC3  11.56,31.17 270 top
IC4  25.53,30.48 270 top
IC5  21.71,23.61 270 top
IC6  15.52,23.53 270 top
IC7  15.75,16.64 90 bottom
L2  20.45,30.61 180 bottom
L3  35.31,3.38 90 bottom
L4  38.35,22.17 270 bottom
LED1  12.67,27.61 90 bottom
Q1  17.02,5.89 180 top
R1  9.07,10.19 0 top
R2  9.02,10.67 0 bottom
R3  45.72,26.54 90 bottom
R4  44.45,26.54 90 bottom
R5  43.18,26.54 90 bottom
R6  10.29,20.29 90 top
R7  6.91,20.83 180 bottom
R8  2.92,5.33 90 top
R9  4.65,5.33 90 top
R12  14.99,25.98 180 bottom
R13  21.89,25.65 180 bottom
R32  5.31,15.04 90 top
R34  45.85,26.8 90 top
R35  44.45,26.8 90 top
R36  43.05,26.8 90 top
R42  10.69,6.1 180 top
R45  19.94,27.81 180 top
R46  19.94,32.89 0 top
R47  1.45,14.99 90 top
R48  9.07,16.89 270 top
R49  24.74,14.91 0 top
R50  9.47,27.61 0 bottom
R52  11.56,4.27 180 top
R65  27.94,8.97 180 bottom
R66  29.49,20.42 270 bottom
R68  24.77,19.3 270 bottom
R69  25.78,9.73 270 bottom
R70  24,22.68 0 bottom
R71  27.05,22.68 0 bottom
S1  4.7,25.37 0 bottom
S3  4.7,15.2 0 bottom
U$1  [A4L-LOC]  -26.69,-75.75 0 top  (outside the outline)
X1  46.99,32.26 0 bottom
X2  34.04,26.67 0 bottom
X3  34.04,31.75 0 bottom
X4  3.56,20.68 270 bottom
X5  49.53,10.76 90 top
X6  5.46,3.68 180 bottom
X7  16.66,3.68 0 bottom
X8  2.9,30.73 180 bottom

### Tracks (layer width: path | path; a pad name or v marks a point on that pad's centre or on a via)
+3V3  (via drill 0.2, 0.3, 0.4, 0.6)
  Top 0.254: v1.96,6.1 1.99,6.18 R8.2 R9.2 4.97,6.2 5.79,6.2 6.04,5.94 6.04,3.05 6.43,2.67 8.99,2.67 9.25,2.92 v9.25,3.94 | C46.1 12.12,13.5 v12.12,12.68
  Top 0.305: v20.32,21.72 20.32,20.83 | 19.01,23.2 C4.1 | v2.13,16.71 1.52,16.01 R47.2 | v1.32,30.79 1.32,31.65 1.63,31.95 4.01,31.95 4.32,31.65 4.32,30.23 4.57,29.97 5.67,29.97 C38.2
  Top 0.406: IC5.3 21.46,22.66 | 21.46,22.66 IC5.4 | 21.46,22.66 21.46,21.28 C5.1 21.42,20.83 20.32,20.83 C4.1 | IC3.3 7.61,30.53 C37.2 C38.2
  Top 0.61: R52.2 9.6,4.27 v9.25,3.94 | 20.88,11.09 C3.1 | C3.1 C45.1 22.58,11.29 v22.58,12.06 | v44.96,5.59 43.56,4.19 43.56,2.67 43.31,2.41 29.34,2.41 v28.83,2.92 28.83,3.56 v22.55,3.56 21.03,2.03 v18.8,2.03 15.9,2.03 15.6,2.34 15.6,3.05 15.27,3.38 v14.1,3.38 | 13.74,17.27 v13.74,15.88 13.74,15.01 13.46,14.73 12.65,14.73 12.34,14.43 12.34,13.7 C46.1 | 13.74,17.27 18.26,17.27 19.01,18.02 C4.1 | 12.45,13.93 C46.1 | 19.76,11.28 20.81,11.28 C3.1 | 19.76,11.28 12.45,11.28 12.14,11.48 12.14,13.57 C46.1 | 13.74,17.27 13.74,18.92 13.26,19.41 11.61,19.41 v11.58,19.43 | 19.76,11.28 v19.76,12.19 | v10.29,22.61 9.6,22.61 9.02,23.19 9.02,23.75 9.04,23.77 9.04,25.25 8.59,25.7 6.35,25.7 5.74,26.31 5.74,29.94 C38.2
  Top 0.813: v53.47,11.81 53.42,11.76 X5.6 50.21,11.76 v50.16,11.81
  Route2 0.61: v22.55,3.56 22.55,3.53 22.58,3.66 v22.58,12.06 | v50.16,11.81 51.18,10.79 51.18,8.51 50.29,7.62 46.99,7.62 v44.96,5.59
  GND 0.254: 9.45,19.43 9.4,17.88 8.99,17.48 2.9,17.48 v2.13,16.71
  GND 0.61: v11.58,19.43 9.45,19.43 9.04,19.74 9.04,23.77 v9.02,23.77
  Bottom 0.254: 10.13,23.56 C47.1 10.03,22.86 v10.29,22.61 10.41,22.5 10.41,20.83 | 10.41,20.83 10.41,20.4 IC7.32 | IC7.19 11.56,13.89 12.12,13.34 v12.12,12.68 | IC7.48 19.53,22.23 19.53,21.72 v20.32,21.72 | v1.96,6.1 2.52,5.53 X6.1 | 8.99,23.65 v9.02,23.77 | R7.2 10.41,20.83
  Bottom 0.305: IC7.64 20.45,12.88 v19.76,12.19 19.81,12.14 19.81,11.28 19.56,11.02 IC7.1 | D4.2 11.56,6.16 11.56,3.38 | X8.1 1.63,31.09 v1.32,30.79
  Bottom 0.406: IC1.4 28.83,9.01 | v9.02,23.77 9.61,23.79 C47.1
  Bottom 0.61: C59.1 28.76,6.65 C64.1 R65.2 28.83,9.01 | v14.1,3.38 11.56,3.38 9.8,3.38 v9.25,3.94 | X7.1 18.6,1.83 v18.8,2.03
  Bottom 0.813: C59.1 28.76,2.99 v28.83,2.92
+5V  (via drill 0.2, 0.6)
  Top 0.254: v0.76,33.66 0.74,33.66 0.51,33.43 0.51,22.4 0.86,22.05 2.04,22.05 X4.P$1
  Top 0.61: C27.1 42.04,18.45 42.04,17.27 37.59,17.27 36.7,18.17 IC2.5
  Top 0.813: X5.15 48.34,11.76 v49.15,12.57 | C26.1 v43.81,20.32 | C27.1 42.51,18.82
  Top 1.016: 42.51,18.82 C26.1
  Route2 0.305: v0.76,33.66 23.11,33.66 24.77,32 24.77,29.46 25.4,28.83 27.56,28.83 27.94,29.21 46.86,29.21
  Route2 0.61: v45.59,18.03 45.59,20.19 45.59,21.08 46.86,22.35 v46.86,25.78 46.86,29.21 48.94,29.21 X1.1
  Route2 0.813: v43.81,20.32 45.47,20.32 45.59,20.19
  Bottom 0.61: R5.1 R4.1 R3.1 46.77,25.69 v46.86,25.78
  Bottom 0.813: v49.15,12.57 49.15,16.64 48.01,17.78 45.85,17.78 v45.59,18.03
AD_TEMP_COIL  (via drill 0.2)
  GND 0.254: v16.13,12.47 16,12.34 16,11.28 15.6,10.87 v11,10.87
  Bottom 0.254: IC7.8 16,12.32 16.1,12.47 v16.13,12.47 | 11.05,10.92 v11,10.87 10.79,10.67 R2.1 8.68,9.48 C2.2
AD_TEMP_FET  (via drill 0.2)
  Top 0.254: R1.1 C1.2 8.22,12.84 v8.64,13.26
  GND 0.254: v15.6,13.26 v8.64,13.26
  Bottom 0.254: IC7.9 15.49,13.16 v15.6,13.26
AD_U_BAT  (via drill 0.2)
  Top 0.254: v8.91,6.2 9.02,6.1 R42.2 10.19,6.1 10.19,7.42 C35.2
  GND 0.254: v6.38,12.7 6.38,13.44 6.86,13.92 10.13,13.92 v12.5,16.28
  Bottom 0.254: IC7.22 11.61,15.39 v12.5,16.28 | 8.91,7.34 8.74,7.34 7.21,8.87 7.21,11.86 v6.38,12.7
  Bottom 0.305: D4.3 8.91,7.11 | 8.91,7.34 8.91,7.11 | 8.91,7.11 v8.91,6.2
BG_U_TTL  (via drill 0.2)
  Top 0.254: v24.99,0.76 45.59,0.76 46.59,1.76 X5.20
  Route2 0.254: v24.99,0.76 3.43,0.76 0.86,3.33 0.86,11.68 1.83,12.65 1.83,14.73 2.13,15.04 10.49,15.04 v11.76,16.31
  Bottom 0.254: IC7.23 11.35,15.88 11.84,16.36 v11.76,16.31
BG_V_TTL  (via drill 0.2)
  Top 0.254: v24.36,1.4 24.61,1.65 26.34,1.65 26.72,1.27 44.83,1.27 45.09,1.52 45.09,2.16 46.69,3.76 X5.19
  Route2 0.254: v1.25,12.93 1.17,13.11 1.17,16.92 1.57,17.32 11,17.32 v11.56,17.88
  GND 0.254: v24.36,1.4 23.47,0.51 3.3,0.51 0.74,3.07 0.74,12.42 v1.25,12.93
  Bottom 0.254: IC7.26 11.05,17.4 v11.56,17.88
BG_W_TTL  (via drill 0.2)
  Top 0.254: v13.61,1.4 14.5,0.51 22.48,0.51 24.13,2.16 26.59,2.16 26.98,1.78 44.32,1.78 44.58,2.03 44.58,3.81 46.53,5.76 X5.18 | v1.57,7.95 1.42,7.98 0.64,8.76 0.64,12.98 v0.56,13.26
  Route2 0.254: v0.56,13.26 0.56,17.37 1.27,18.09 v3.71,18.09
  GND 0.254: v13.61,1.4 13.26,1.02 4.06,1.02 1.37,3.71 1.37,6.5 1.57,6.71 v1.57,7.95
  Bottom 0.254: IC7.27 8.84,17.88 8.74,17.73 4.06,17.73 v3.71,18.09
BOOT0  (via drill 0.2)
  Top 0.254: R49.1 23.85,14.9 v22.94,14.91
  Bottom 0.254: v22.94,14.91 22.94,14.88 IC7.60
BOOT1  (via drill 0.2)
  Top 0.254: v8.1,18.29 8.61,18.25 R48.1
  Bottom 0.254: IC7.28 8.2,18.39 v8.1,18.29
CAN1_H  (via drill 0.3, 0.4)
  Top 0.406: IC4.1 25.69,29.63 23.66,27.6 C41.2 22.19,27.6 21.97,27.81 21.97,28.83 21.59,29.21 v20.95,29.21 | R45.2 19.05,27.81 v19.05,29.21
  Top 0.813: IC4.1 27.22,29.63 v27.56,29.97 31.67,29.97 X3.P$3
  Bottom 0.406: v19.05,29.21 v20.95,29.21 21.1,29.36 L2.2
  Bottom 1.27: X3.P$3 X2.P$3
CAN1_L  (via drill 0.3, 0.4)
  Top 0.406: IC4.2 25.69,31.33 23.79,33.23 C40.1 22.31,33.23 21.97,32.89 21.97,31.88 21.59,31.5 v20.95,31.5 | R46.1 18.92,32.89 v18.92,31.5
  Top 0.813: IC4.2 27.22,31.33 v27.56,30.99
  Route2 0.61: v27.56,30.99 32.84,30.99 X3.P$2
  Bottom 0.406: v18.92,31.5 v20.95,31.5 23.89,31.5 L2.3
  Bottom 1.27: X3.P$2 X2.P$2
CAN1_RX  (via drill 0.2, 0.3)
  Top 0.254: v10.72,29.26 IC3.4
  Route2 0.254: v17.4,26.29 17.4,28.88 17.02,29.26 v10.72,29.26
  Bottom 0.254: IC7.44 17.5,26.19 v17.4,26.29
CAN1_TX  (via drill 0.2, 0.3)
  Top 0.305: IC3.1 10.46,33.07 v10.82,32.72
  Route2 0.254: v18.03,26.67 18.03,29.36 17.27,30.12 11.33,30.12 10.82,30.63 v10.82,32.72
  Bottom 0.254: IC7.45 18.01,26.64 v18.03,26.67
CAN_12V
  Bottom 1.27: X3.P$1 X2.P$1
CS_AS5048  (via drill 0.2)
  Route2 0.254: v17.8,14.83 19.15,13.49 19.15,10.41 18.75,10.01 18.75,9.09 18.24,8.59 17.68,8.59 16.92,7.82 v15.6,7.82
  Bottom 0.254: IC7.41 16,20.68 15.88,20.55 15.88,15.11 16.15,14.83 v17.8,14.83 | X7.6 15.39,6.04 15.6,6.25 v15.6,7.82
CS_DMS  (via drill 0.2)
  Route2 0.254: v13.39,20.37 13.51,20.5 13.51,27.53 13.31,27.74 v4.88,27.74
  Bottom 0.254: IC7.36 13.49,20.37 v13.39,20.37 | v4.88,27.74 4.14,27.74 X8.6
DAC_1  (via drill 0.2)
  Route2 0.254: v4.22,7.21 4.7,6.73 5.69,6.73 5.94,6.99 5.94,7.52 7.92,9.5 9.35,9.5 9.6,9.75 9.6,12.39 10.82,13.61 12.55,13.61 12.85,13.31 v12.85,12.7
  Bottom 0.254: X6.3 4.19,7.19 v4.22,7.21 | IC7.20 12.34,14.38 12.85,13.87 v12.85,12.7
DAC_2  (via drill 0.2)
  Route2 0.254: v5.26,7.32 5.23,7.34 5.23,7.47 7.82,10.06 8.79,10.06 9.09,10.36 9.09,12.65 11.99,15.49 v12.55,15.49
  Bottom 0.254: X6.5 5.46,7.11 v5.26,7.32 | IC7.21 11.94,14.88 v12.55,15.49
GND  (via drill 0.2, 0.3, 0.6, 0.8)
  Top 0.203: C5.2 22.86,21.28 v22.86,20.32
  Top 0.254: C54.2 10.69,1.65 v9.53,1.65 6.41,1.65 C11.2 | C6.1 8.74,16.07 R48.2 | R49.2 26.04,14.61 | C46.2 13.95,13.68 v13.95,12.57 | C1.1 9.45,11.67 9.69,11.58 10.97,11.58 11.38,11.99 v11.38,12.65 | v17.88,7.95 17.88,8.4 C42.2 | C43.2 3.45,16.1 | R48.2 8.75,16.09 | 3.48,16.09 C43.2 | C12.2 3.06,1.89 3.81,2.64 v3.81,3.61 | C43.2 5.08,14.19 R32.1 C30.1 8.65,14.19 9.04,14.58 9.04,16.02 R48.2 | R48.2 8.8,16.04 v8.08,16.76
  Top 0.305: 17.31,20.98 C4.2 | IC5.2 21.34,23.61 v21.34,23.62 | IC6.2 15.49,23.85 v15.49,23.75
  Top 0.406: C40.2 22.99,30.61 22.86,30.48 | C41.1 22.99,30.35 23.11,30.48 | C42.2 C44.2 | C3.2 20.95,9.64 v20.19,9.65 | IC3.2 7.35,31.8 C37.1 5.69,31.89 C38.1
  Top 0.61: C39.1 21.02,30.48 22.86,30.48 23.11,30.48 IC4.3 v25.65,30.48 | C54.2 C52.2 | C35.1 8.8,7.47 8.64,7.47 v8.64,8.38 | v25.02,17.14 26.04,16.13 26.04,14.61 26.04,13.08 25.4,12.45 v25.4,12.14 | 46.99,22.9 C33.1 41.31,22.9 | 46.99,22.9 47.24,22.9 47.79,22.35 v48.39,22.35 | C34.1 41.31,22.9 | IC2.2 40.55,19.43 40.68,19.3 | C32.1 46.99,24.17 46.99,22.9 | C4.2 17.91,20.23 v17.91,19.81 | C26.2 40.81,22.39 41.31,22.9 | C45.2 21.11,9.29 C3.2 | 5.69,31.89 5.69,32.76 v5.69,32.82
  Top 1.016: C26.2 40.68,20.29 40.68,19.3 C27.2 | X5.7 X5.14
  Route2 0.254: v8.64,8.38 8.28,8.38 7.72,7.82 v7.72,7.26
  GND 0.254: v3.81,3.61 3.81,3.66 | v8.08,16.76 8.08,16.82
  GND 0.305: v14.83,27.58 14.88,27.58 | v1.47,27.13 1.42,27.13 1.37,27.08
  GND 0.61: v5.69,32.82 5.69,32.92
  Bottom 0.203: C57.2 27.9,21.5 27.9,21.84
  Bottom 0.254: IC7.12 13.99,12.42 v13.95,12.57 | IC7.18 11.18,13.39 11.35,13.21 11.35,12.62 v11.38,12.65 | C2.1 10.41,9.36 10.41,8.37 | C8.1 26.16,27.27 C9.1 v26.16,27.79 | IC7.63 22.68,13.39 22.86,13.23 v22.86,12.85 | S1.P$1 7.64,26.03 7.77,25.86 7.78,23.01 C7.2 | v7.72,7.26 7.72,5.81 X6.9 | X7.2 17.93,7.95 v17.88,7.95 | S3.P$1 8.2,16.64 v8.08,16.76
  Bottom 0.305: 17.91,7.98 v17.88,7.95 | v8.64,8.38 8.64,8.37 10.41,8.37 11.59,8.37 D4.1 | LED1.C 14.86,27.61 v14.83,27.58 | X8.2 1.63,27.28 v1.47,27.13
  Bottom 0.406: 30.86,19.63 30.86,19.28 30.13,18.55 IC1.13 30.13,15.98 IC1.POWERPAD | v25.65,30.48 26.29,30.48 26.42,30.61 26.42,31.62 27.1,32.31 X3.P$4 | C51.2 19.72,26.67 v19.94,26.67 | C47.2 C50.2
  Bottom 0.6: S1.P$1 8.54,25.49 C47.2
  Bottom 0.61: 10.03,25.27 C47.2 v10.03,26.44 | v25.02,17.14 23.88,17.14 23.5,17.53 23.5,19.18 24.47,20.15 R68.1 24.77,21.08 26.12,21.08 C60.2 26.16,21.37 C57.2 | R69.1 25.4,10.96 v25.4,12.14
  Bottom 0.813: 30.86,19.63 30.86,24.08 30.65,24.29 C56.2 | R71.1 27.9,21.84
  other vias: 45.21,14.61 44.2,15.62 44.2,14.61 45.21,15.62 30.99,14.73 31.11,13.34 31.75,15.88
  pour Bottom (isolate 0.254): 45.9,11.75 45.9,16.71 35.43,16.71 35.43,17.86 32,17.86 32,16.33 30.86,16.33 30.86,13.03 32,13.06 32.08,11.58 32.41,11.75
  pour Bottom (no thermals): 30.86,13.03 30.86,16.46 23.5,16.46 23.5,2.74 27.94,2.74 27.94,7.7 24.77,7.7 24.77,13.03
  pour Top (no thermals): 45.85,14.48 48.64,14.48 48.64,13.34 43.69,13.34 43.69,16.76 45.85,16.76
  pour GND: -0.64,36.2 55.88,36.2 55.88,-1.27 -0.64,-1.27
GS0_INA225  (via drill 0.2)
  Top 0.254: IC6.5 16.51,22.55 15.44,21.49 v15.44,21.08
  Bottom 0.254: v15.44,21.08 15.49,21.18 IC7.40
GS1_INA225  (via drill 0.2)
  Top 0.254: IC6.6 16.55,23.2 15.09,21.74 13.61,21.74 v12.95,21.08
  Bottom 0.254: IC7.35 12.95,22.2 v12.95,21.08
HALL_U  (via drill 0.2)
  Top 0.406: C34.2 42.55,24.17 v42.55,23.62
  Top 0.61: R36.1 43.05,24.68 C34.2
  Route2 0.254: v42.55,23.62 40.21,25.91 v30.68,25.91 | v22.71,16.51 29.16,16.51 29.52,16.87 v29.52,25.86
  Bottom 0.254: IC7.58 22.28,15.88 22.55,16.15 22.55,16.36 v22.71,16.51 | v30.68,25.91 29.62,25.91 29.62,25.86 v29.52,25.86
HALL_V  (via drill 0.2)
  Top 0.406: v43.31,23.62 43.6,23.62 C33.2 44.58,25.82 R35.1
  Route2 0.254: v43.31,23.62 44.45,24.77 R35.1 41.82,28.57 30.68,28.57 30.33,28.22 30.33,26.52 30.02,26.21 30.07,16.2 29.57,15.7 v22.91,15.7
  Bottom 0.254: IC7.59 22.61,15.39 v22.91,15.7
HALL_W  (via drill 0.2)
  Top 0.406: R34.1 45.85,24.8 C32.2 45.72,24.6 v45.72,23.75
  Route2 0.254: v45.72,23.75 44.96,22.99 41.78,22.99 39.45,25.32 v31.27,25.32 | v20.09,16.15 20.09,17.45 20.4,17.75 25.58,17.75 25.91,18.09 27.38,18.09 28.6,19.3 v28.6,25.3
  Bottom 0.254: v28.6,25.3 30.58,25.3 v31.27,25.32 | IC7.61 20.32,14.38 20.09,14.61 v20.09,16.15
IC6  (via drill 0.2)
  Top 0.254: v14.61,24.51 14.6,24.5
  Top 0.406: 14.6,24.5 IC6.1 | C14.2 14.7,24.6 v14.61,24.51
  Bottom 0.254: R12.1 14.61,25.52 v14.61,24.51
IMESS  (via drill 0.2)
  Top 0.254: 12.75,17.22 12.72,17.2 12.72,17.3 12.78,17.17 v12.7,17.2 10.82,17.2 10.49,17.53 10.31,17.53 C6.2 | C6.2 10.31,17.89 | R6.1 10.29,17.82 C6.2
  Bottom 0.254: IC7.17 10.16,12.85 10.16,12.34 10.36,12.14 13.16,12.14 13.36,12.34 13.36,14.94 13.11,15.19 13.11,16.79 v12.7,17.2
JTCK-SWCLK  (via drill 0.2)
  Top 0.254: R9.1 v4.65,3.56 4.65,1.42 C11.1
  Route2 0.254: v4.65,3.56 R9.1 5.24,5.08 12.14,5.08 12.9,5.84 12.9,8.13 13.16,8.38 13.46,8.38 13.97,8.89 16.15,8.89 17.83,10.57 17.83,13.87 17.02,14.63 17.02,15.39 17.32,15.7 v17.63,15.7
  Bottom 0.254: IC7.49 19.81,20.4 19.43,20.07 19.43,15.93 19.2,15.7 v17.63,15.7 | X6.4 4.19,3.1 v4.65,3.56
JTMS-SWDIO  (via drill 0.2)
  Top 0.254: R8.1 v2.92,3.56 1.78,3.56 C12.1
  Route2 0.254: v17.3,16.48 16.51,15.7 16.51,14.38 17.32,13.56 17.32,10.82 16.87,10.36 12.7,10.36 12.34,10.01 12.34,6.15 11.79,5.59 3.43,5.59 2.92,5.08 v2.92,3.56
  Bottom 0.254: X6.2 v2.92,3.56 | IC7.46 18.49,20.73 18.75,20.47 18.75,16.76 18.44,16.46 17.27,16.46 v17.3,16.48
LED1  (via drill 0.2)
  GND 0.305: v8.26,19.56 7.98,19.84 7.98,24.13 7.32,24.79 v6.35,24.79
  Bottom 0.305: IC7.30 8.43,19.38 v8.26,19.56 | R50.2 6.93,27.61 6.35,27.03 v6.35,24.79
N$1  (via drill 0.3)
  Top 0.254: v20.02,25.65 19.51,25.15 18.75,25.15 18.15,24.5 IC6.8
  Top 0.406: C14.1 16.39,24.75 16.66,24.49 17.7,24.49 IC6.8
  Bottom 0.254: R13.1 v20.02,25.65
N$2  (via drill 2.6 pad 5.3)
  other vias: 4,10.5
N$3
  Bottom 0.61: R50.1 LED1.A
N$4
  Top 0.61: R34.2 46.99,28.79 X1.3
  Bottom 0.61: R3.2 46.99,28.66 X1.3
N$5
  Top 0.61: R35.2 44.49,27.69 X1.4
  Bottom 0.61: R4.2 44.49,27.43 X1.4
N$6
  Top 0.61: R36.2 41.99,28.71 X1.5
  Bottom 0.61: R5.2 41.99,28.58 X1.5
N$7
  Top 0.305: IC6.4 11.48,22.55 10.26,21.34 10.26,20.92 R6.2
N$8  (via drill 0.2)
  Top 0.305: IC5.5 v21.72,24.56 | IC6.3 13.36,23.24 14.99,23.24 15.24,22.99 15.67,22.99 16.28,23.6 v16.28,23.8
  Route2 0.305: v21.72,24.56 17.04,24.56 v16.28,23.8
N$10
  Top 0.305: IC5.1 19.18,24.56 19.18,23.88 17.72,23.88 IC6.7
N$11  (via drill 2.7 pad 5.3)
  other vias: 51.5,25.5
N$16
  Bottom 0.406: IC1.12 29.48,19.4 29.21,19.67
  Bottom 0.61: R66.2 29.21,19.67 C57.1
N$17
  Bottom 0.813: R66.1 C56.1
N$18
  Bottom 0.305: IC1.5 28.18,10.86 27.09,9.77 R65.1
  Bottom 0.61: R65.1 27,8.88 R69.2
N$23  (via drill 0.2)
  Top 0.254: C58.2 32.6,16.37 v31.5,17.48
  Bottom 0.254: v31.5,17.48 IC1.14
  Bottom 0.406: IC1.14 30.78,18.03 31.01,18.11
  Bottom 0.61: 31.01,18.11 31.24,18.36 32.26,19.38
  pour Bottom: 37.97,24.46 37.97,20.02 35.56,20.02 35.56,18.62 31.75,18.62 31.75,24.46
N$25  (via drill 0.2)
  Top 0.203: v28.83,18.52 28.19,19.15 28.19,21.79 v26.16,23.7
  Bottom 0.203: IC1.11 v28.83,18.52 | 26.16,22.72 R71.2
  Bottom 0.254: 26.16,22.72 v26.16,23.7
  Bottom 0.61: R71.2 R70.1
N$26
  Bottom 0.203: IC1.10 28.18,18.76 28.12,18.82 27.56,18.82 26.9,18.82 26.8,18.92 26.58,18.92 C60.1 26.16,19.56
N$27
  Bottom 0.203: IC1.9 27.53,18.39 27.48,18.44 26.67,18.44 26.57,18.44 26.42,18.29 25.06,18.29 R68.2
N$28  (via drill 0.2)
  Top 0.254: v26.16,11.89 26.67,12.39 26.67,16.89 26.21,17.35 v26.04,17.35
  Route2 0.254: v26.16,11.89 30.18,11.89 30.48,11.63 v30.48,10.06
  Bottom 0.254: IC1.7 v26.16,11.89 | v26.04,17.35 26.17,17.48 IC1.8
  Bottom 0.406: IC1.2 30.13,10.38 30.12,9.02
  pour Bottom (isolate 0.254, rank 3): 30.1,10.62 30.1,3.76 39.6,3.76 39.6,11.1 31.85,11.1 31.8,10.03 31.19,10.03 30.61,10.62
N$30  (via drill 0.2)
  Top 0.305: C58.1 31.19,11.9 v31.19,10.67
  Top 0.406: 30.99,11.8 C58.1
  Bottom 0.305: IC1.1 30.76,11.54 30.76,11 v31.19,10.67
N$38
  Top 0.406: 18.99,30.03 C39.2 | R46.2 C39.2 | R45.1 C39.2
N$70  (via drill 0.2)
  Top 0.254: v14.68,9.8 14.68,8.65 C44.1
  Top 0.6: 14.64,5.36 C44.1
  Top 0.813: Q1.P$2 14.64,5.36
  Bottom 0.254: IC7.6 16.99,9.83 16.84,9.68 14.71,9.68 v14.68,9.8
N$85  (via drill 0.2)
  Top 0.254: 19.41,8.99 v19.41,9.8
  Top 0.6: Q1.P$1 19.37,8.86 C42.1 19.32,8.98 19.41,8.99
  Bottom 0.254: IC7.5 17.5,9.98 17.68,9.8 v19.41,9.8
N$89  (via drill 0.3)
  Top 0.305: v12.9,31.8 IC3.7
  Bottom 0.305: L2.1 15.14,29.36 14.73,29.77 14.73,31.45 14.38,31.8 v12.9,31.8
N$96  (via drill 0.3)
  Top 0.305: IC3.6 16.51,30.53 v16.76,30.79
  Bottom 0.305: v16.76,30.79 L2.4
NRST  (via drill 0.2)
  Top 0.254: 1.79,14.17 R47.1 1.88,14.16 | v8.05,3.58 7.9,3.58 7.16,4.32 7.16,9.2 | 7.16,9.2 7.16,12.75 v7.21,12.8 | 7.16,9.2 7.19,9.17 11.4,9.17 v11.48,9.25
  Top 0.305: R47.1 2.44,14.14 | 2.44,14.14 3.33,14.14 C43.1 | v2.44,14.43 2.44,14.14
  Route2 0.254: v11.48,9.25 11.48,10.46 11.84,10.82 16.41,10.82 16.76,11.18 16.76,12.95 v16.36,13.36
  Bottom 0.254: v8.05,3.58 8,3.43 X6.10 | v7.21,12.8 5.61,14.4 2.54,14.4 v2.44,14.43 1.57,14.43 1.37,14.63 1.32,14.43 1.2,14.55 S3.P$2 | IC7.7 16.51,11.99 16.76,12.24 16.76,13.01 16.41,13.36 v16.36,13.36
SHUNT+  (via drill 0.2)
  Top 0.254: v39.88,29.97 38.61,28.7 28.19,28.7 27.94,28.45 27.94,25.7 v27.64,25.4 | X5.12 48.37,17.76 49.78,19.18 49.78,20.32 49.91,20.45 50.67,20.45 50.8,20.57 50.8,21.08 51.18,21.46 C13.2 51.4,21.59 v52.32,21.59 | v50.16,28.96 50.16,29.72 v49.02,30.86
  Route2 0.254: v39.88,29.97 48.26,29.97 49.02,30.73 | 49.4,22.61 48.26,23.75 48.26,27.05 v50.16,28.96 | 49.4,22.48 50.29,21.59 v52.32,21.59
  Route2 0.305: 49.4,22.48 49.4,22.61 | v49.02,30.86 49.02,30.73
  Bottom 0.254: R13.2 22.75,24.8 22.91,24.64 26,24.64 C9.2 26.25,25.4 v27.64,25.4
SHUNT-  (via drill 0.2)
  Top 0.254: v39.24,30.61 37.85,29.21 27.94,29.21 27.15,28.42 v27.15,28.3 | v48.01,28.07 v48.01,31.37 | 46.61,19.81 46.74,19.68 47.17,19.68 X5.11
  Top 0.406: 46.61,19.81 47.92,19.81 C13.1 49.57,22.44 48.77,23.24 v48.01,23.24
  Route2 0.254: v39.24,30.61 48.01,30.61 48.13,30.73 48.01,30.86 v48.01,31.37 | v48.01,28.07 47.5,27.56 47.5,23.88 48.13,23.24 v48.01,23.24
  Bottom 0.254: 15.89,26.05 R12.2 15.88,26.23 15.88,27 16.1,27.28 23.37,27.28 23.7,26.9 23.7,25.81 23.94,25.55 C8.2 24.98,25.91 27.03,25.91 27.15,26.04 v27.15,28.3
SPI2_MISO  (via drill 0.2)
  Route2 0.254: v2.9,27.03 11.38,27.03 11.58,26.82 11.58,21.59 v12.19,20.98
  Bottom 0.254: IC7.10 14.99,17.53 13.41,19.1 13.41,19.51 12.6,20.32 12.6,20.55 12.19,20.95 v12.19,20.98 | v2.9,27.03 X8.4
SPI2_MOSI  (via drill 0.2)
  Route2 0.254: v11.91,20.27 10.92,21.26 10.92,25.35 10.52,25.76 2.85,25.76 2.29,26.36 v2.29,30.73
  Bottom 0.254: v11.91,20.27 12.8,19.38 12.8,18.85 14.5,17.14 IC7.11 | X8.3 2.9,31.29 v2.29,30.73
SPI2_SCK  (via drill 0.2)
  Top 0.254: v3.76,24.69 3.76,30.73 v3.71,30.79
  Bottom 0.254: IC7.29 5.13,18.9 4.72,19.3 4.72,23.72 v3.76,24.69 | X8.5 4.2,32.77 4.2,31.27 v3.71,30.79
SPI3_MISO  (via drill 0.2)
  Top 0.254: v20.73,12.12 20.83,19.05 v20.07,19.81
  Route2 0.254: v16.66,7.21 20.83,7.21 21.18,7.57 21.18,11.66 v20.73,12.12
  Bottom 0.254: IC7.52 20.42,18.9 20.07,19.25 v20.07,19.81 | X7.4 v16.66,7.21
SPI3_MOSI  (via drill 0.2)
  GND 0.254: v20.09,18.36 20.17,18.39 21.13,18.39 21.34,18.19 21.39,12.04 21.39,8.99 20.47,8.08 20.47,3.86 20.12,3.5 v16.66,3.5
  Bottom 0.254: IC7.53 20.04,18.39 19.96,18.41 v20.09,18.36 | X7.3 16.64,2.21 v16.66,3.5
SPI3_SCK  (via drill 0.2)
  GND 0.254: v22.61,19.3 22.53,19.38 22.2,19.38 21.89,19.07 21.89,8.53 21.03,7.67 21.03,3.3 20.57,2.85 15.09,2.85 v14.68,2.39
  Bottom 0.254: IC7.51 22.53,19.38 v22.61,19.3 | X7.5 15.39,2.39 v14.68,2.39
SUP_DRIV  (via drill 0.2, 0.6)
  Top 0.254: v42.8,17.48 42.8,11.94 41.99,11.12 34.67,11.12 33.02,9.47 29.69,9.47 29.41,9.75 29.41,10.44 v29.46,10.49
  Top 0.61: IC2.4 37.4,20.08 v37.8,19.43
  Top 0.813: v29.46,10.49 27.43,12.52 27.43,21.01 25.15,23.29 v25.15,23.88 25.15,23.75
  Top 1.27: X5.17 X5.4 53.1,7.76 v53.47,8.13
  Bottom 0.254: IC1.3 29.48,10.51 v29.46,10.49 | 42.8,19.38 42.67,19.51
  Bottom 0.813: v25.15,23.88 23.5,23.88 23.11,23.5 23.11,22.72 R70.2
  Bottom 1.016: v53.47,8.13 53.47,9.7 52.32,10.85 52.32,18.8 49.91,21.21 47.62,21.21 46.48,22.35 42.29,22.35
  pour Bottom (rank 3): 43.05,17.22 36.2,17.22 36.2,19.63 38.35,19.63 38.35,24.33 43.05,24.33
TEMP_COIL
  Top 0.254: C30.2 R32.2 5.31,19.02 4.78,19.56 3.02,19.56 X4.P$2
  Bottom 0.254: R2.2 8.17,12.86 5.79,15.24 3.05,15.24 2.9,15.39 2.9,19.43 X4.P$2
TEMP_FET  (via drill 0.2)
  Top 0.254: v29.84,3.3 29.59,3.56 29.59,3.81 28.83,4.57 22.48,4.57 21.72,5.33 v21.74,5.33 | 9.5,10.15 R1.2 9.44,10.16 11.79,10.16 12.14,9.8 12.14,9.25 12.34,8.99 12.85,8.99 v13.03,8.97
  Top 0.406: X5.13 v47.24,16.64
  Route2 0.254: 51.69,11.94 52.07,11.56 52.07,7.37 50.8,6.1 50.8,4.32 49.91,3.43 49.91,2.67 30.48,2.67 v29.84,3.3
  Route2 0.305: v47.24,16.64 49.02,16.64 50.04,15.62 50.04,13.59 51.69,11.94
  Bottom 0.254: v21.74,5.33 20.78,5.33 20.32,5.79 20.32,8.53 19.89,8.97 v13.03,8.97
TG_U_TTL  (via drill 0.2)
  Top 0.254: v51.31,0.89 51.81,0.89 X5.1
  Route2 0.254: v51.31,0.89 51.31,0.64 26.29,0.64 24.89,2.03 24.89,10.41 23.62,11.68 23.62,12.95 23.22,13.36 20.22,13.36 18.34,15.24 18.34,16.97 17.98,17.32 16.1,17.32 v15.29,18.14
  Bottom 0.254: IC7.37 13.99,19.43 v15.29,18.14
TG_V_TTL  (via drill 0.2)
  Top 0.254: v51.81,2.92 v51.82,2.92 X5.2
  Route2 0.254: v51.82,2.92 51.82,2.41 50.55,1.14 26.42,1.14 25.4,2.16 25.4,10.54 24.13,11.81 24.13,13.21 23.5,13.84 23.47,13.82 20.47,13.82 18.95,15.29 18.95,17.68 18.39,18.24 16.1,18.24 v15.24,19.1
  Bottom 0.254: IC7.38 14.5,19.84 v15.24,19.1
TG_W_TTL  (via drill 0.2)
  Top 0.254: X5.3 52.07,5.76 v52.07,4.83
  Route2 0.254: v52.07,4.83 52.07,4.19 50.93,3.05 50.93,2.16 50.42,1.65 26.67,1.65 25.91,2.41 25.91,10.67 24.64,11.94 24.64,13.34 23.6,14.38 20.62,14.38 19.46,15.54 19.46,18.39 19.05,18.8 16.46,18.8 v15.29,19.96
  Bottom 0.254: v15.29,19.96 14.94,20.32 14.94,21.54 14.99,21.59 IC7.39
U_BAT  (via drill 0.2)
  Top 0.254: X5.8 51.83,15.75 v53.34,15.75 | v27.3,2.41 27.08,2.64 23.77,2.64 22.15,1.02 15.04,1.02 v13.59,2.46 | v11.68,7.09 11.71,6.1 R42.1
  Route2 0.254: v53.34,15.75 53.34,13.84 52.58,13.08 52.58,7.11 51.31,5.84 51.31,4.19 50.42,3.3 50.42,2.29 50.29,2.16 27.56,2.16 v27.3,2.41
  GND 0.254: v11.68,7.09 11.68,2.74 11.94,2.49 13.56,2.49 v13.59,2.46
USART1_RX  (via drill 0.2)
  Route2 0.203: v17.14,19.33 17.14,20.7
  Route2 0.254: 17.14,20.7 16.1,21.74 15.01,21.74 14.02,20.75 14.02,17.53 14.63,16.92 14.63,11.94 14.12,11.43 10.62,11.43 10.21,11.02 10.21,9.14 9.98,8.91 8,8.91 6.6,7.52 v6.6,7.21
  Bottom 0.254: 17.02,22.23 IC7.43 16.99,21.11 17.14,20.95 v17.14,19.33 | X6.7 6.58,5.71 v6.6,7.21
USART1_TX  (via drill 0.2)
  Route2 0.254: v16.51,19.79 15.72,20.57 14.78,20.57 14.61,20.4 14.61,17.86 15.9,16.56 v15.9,14.2 | v6.73,3.56 6.76,3.53 6.76,4.32 7.01,4.57 12.75,4.57 13.61,5.44 13.61,7.82 14.22,8.43 16.51,8.43 18.44,10.36 v18.44,12.6
  GND 0.254: v15.9,14.2 18.01,14.2 18.44,13.77 v18.44,12.6
  Bottom 0.254: IC7.42 v16.51,19.79 | v6.73,3.56 6.86,3.56 6.73,3.43 X6.8
USER_BTN  (via drill 0.2)
  Route2 0.254: v12.24,18.54 11.33,18.54 10.92,18.95 10.92,19.91 10.67,20.12 6.35,20.12 v6.1,19.86
  Bottom 0.254: C7.1 R7.1 6.06,20 v6.1,19.86 | IC7.24 10.97,16.38 12.24,17.65 v12.24,18.54 | C7.1 5.82,22.43 | S1.P$2 1.37,25.86 1.37,25.55 5.18,25.55 5.59,25.15 5.59,24.38 6.04,23.93 6.04,22.34 C7.1
  Bottom 0.305: 1.43,26.06 S1.P$2
VBAT+  (via drill 0.6)
  Bottom 0.813: 42.67,6.93 C22.1
  Bottom 2.184: L3.1 41.3,1.63 42.67,3 42.67,6.93
  other vias: 48.9,10.41 50.04,10.41 48.9,9.4 50.04,9.4 40.89,9.27 41.91,9.27 42.93,9.27 43.94,9.27 44.96,9.27
  pour Top (no thermals): 46.1,10.92 53.59,10.92 53.59,9.02 46.1,9.02
  pour Bottom (rank 2, no thermals): 40.26,9.91 45.72,9.91 45.72,8.26 40.26,8.26
  pour Bottom (isolate 0.254, no thermals): 40.25,10.92 51,10.92 51,7.75 40.25,7.75
VCAP1
  Bottom 0.254: IC7.31 11.07,19.89 11.25,20.07 11.25,23.57 11.18,23.65 11.18,23.66 C50.1
VCAP2
  Bottom 0.254: IC7.47 19,24.12 C51.1
VDDA  (via drill 0.2)
  Top 0.305: R52.1 12.57,4.32 12.68,4.42 12.68,6.99 13.66,7.98 v13.66,9.6
  Top 0.61: R52.1 12.41,4.32 C52.1
  Top 0.813: C52.1 C54.1
  Bottom 0.305: IC7.13 13.49,9.83 v13.66,9.6

### Text on the board
Bottom: V1.2 / NMJ
tPlace: V1.2
Document: 70µm | 290µm | 70µm | 710µm | 70µm | Lötstopp beidseitig / Bestückungsdruck beidseitig / Oberfläche chem Gold, alternativ chem. Silber / E-Test / / Nach Möglichkeit Fertigung im Nutzenrahmen / mit Trennstegen, Anordnung 3x2 / Kein bestimmter Nutzenrahmen da Handbestückung | 290µm | 70µm